# Altium schematic sheet rt10.SchDoc: rt10
size 885 x 596 mm; Origin: Eagle; Date: 3/22/2023 6:36:02 AM; SheetNumber: 1; GateName_1: G$1; SymbolName_1: FRAME_D_L; LibraryName: frames; DeviceSetName: FRAME_D_L; GateName_2: G$2; SymbolName_2: DOCFIELD; Sheet: Sheet:; REV: REV:
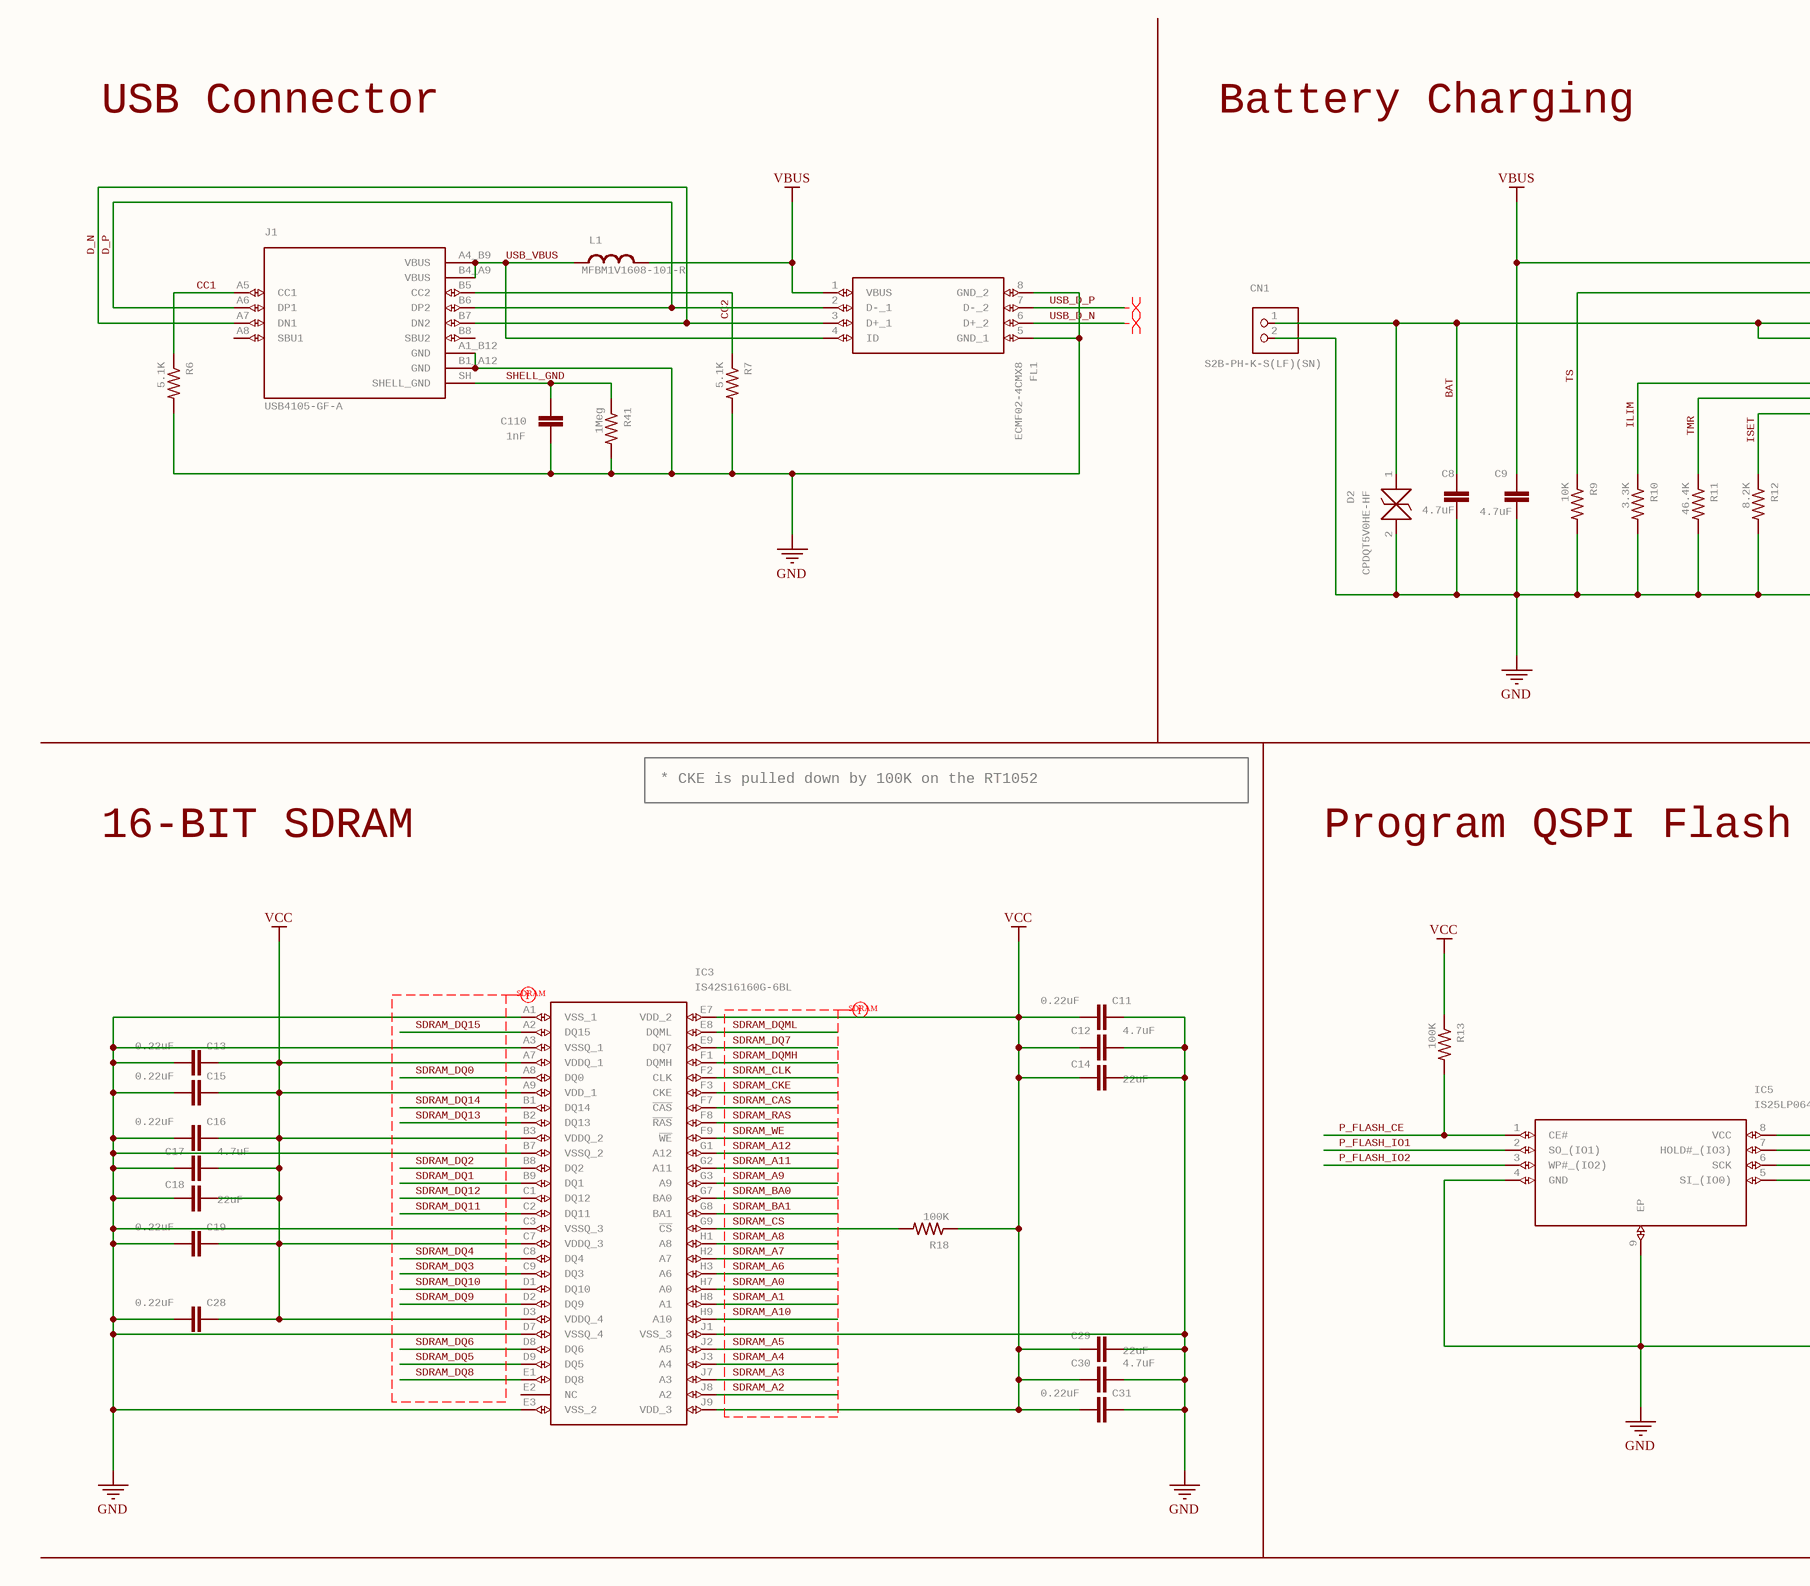
[diagram p0: rt10.SchDoc, top left]
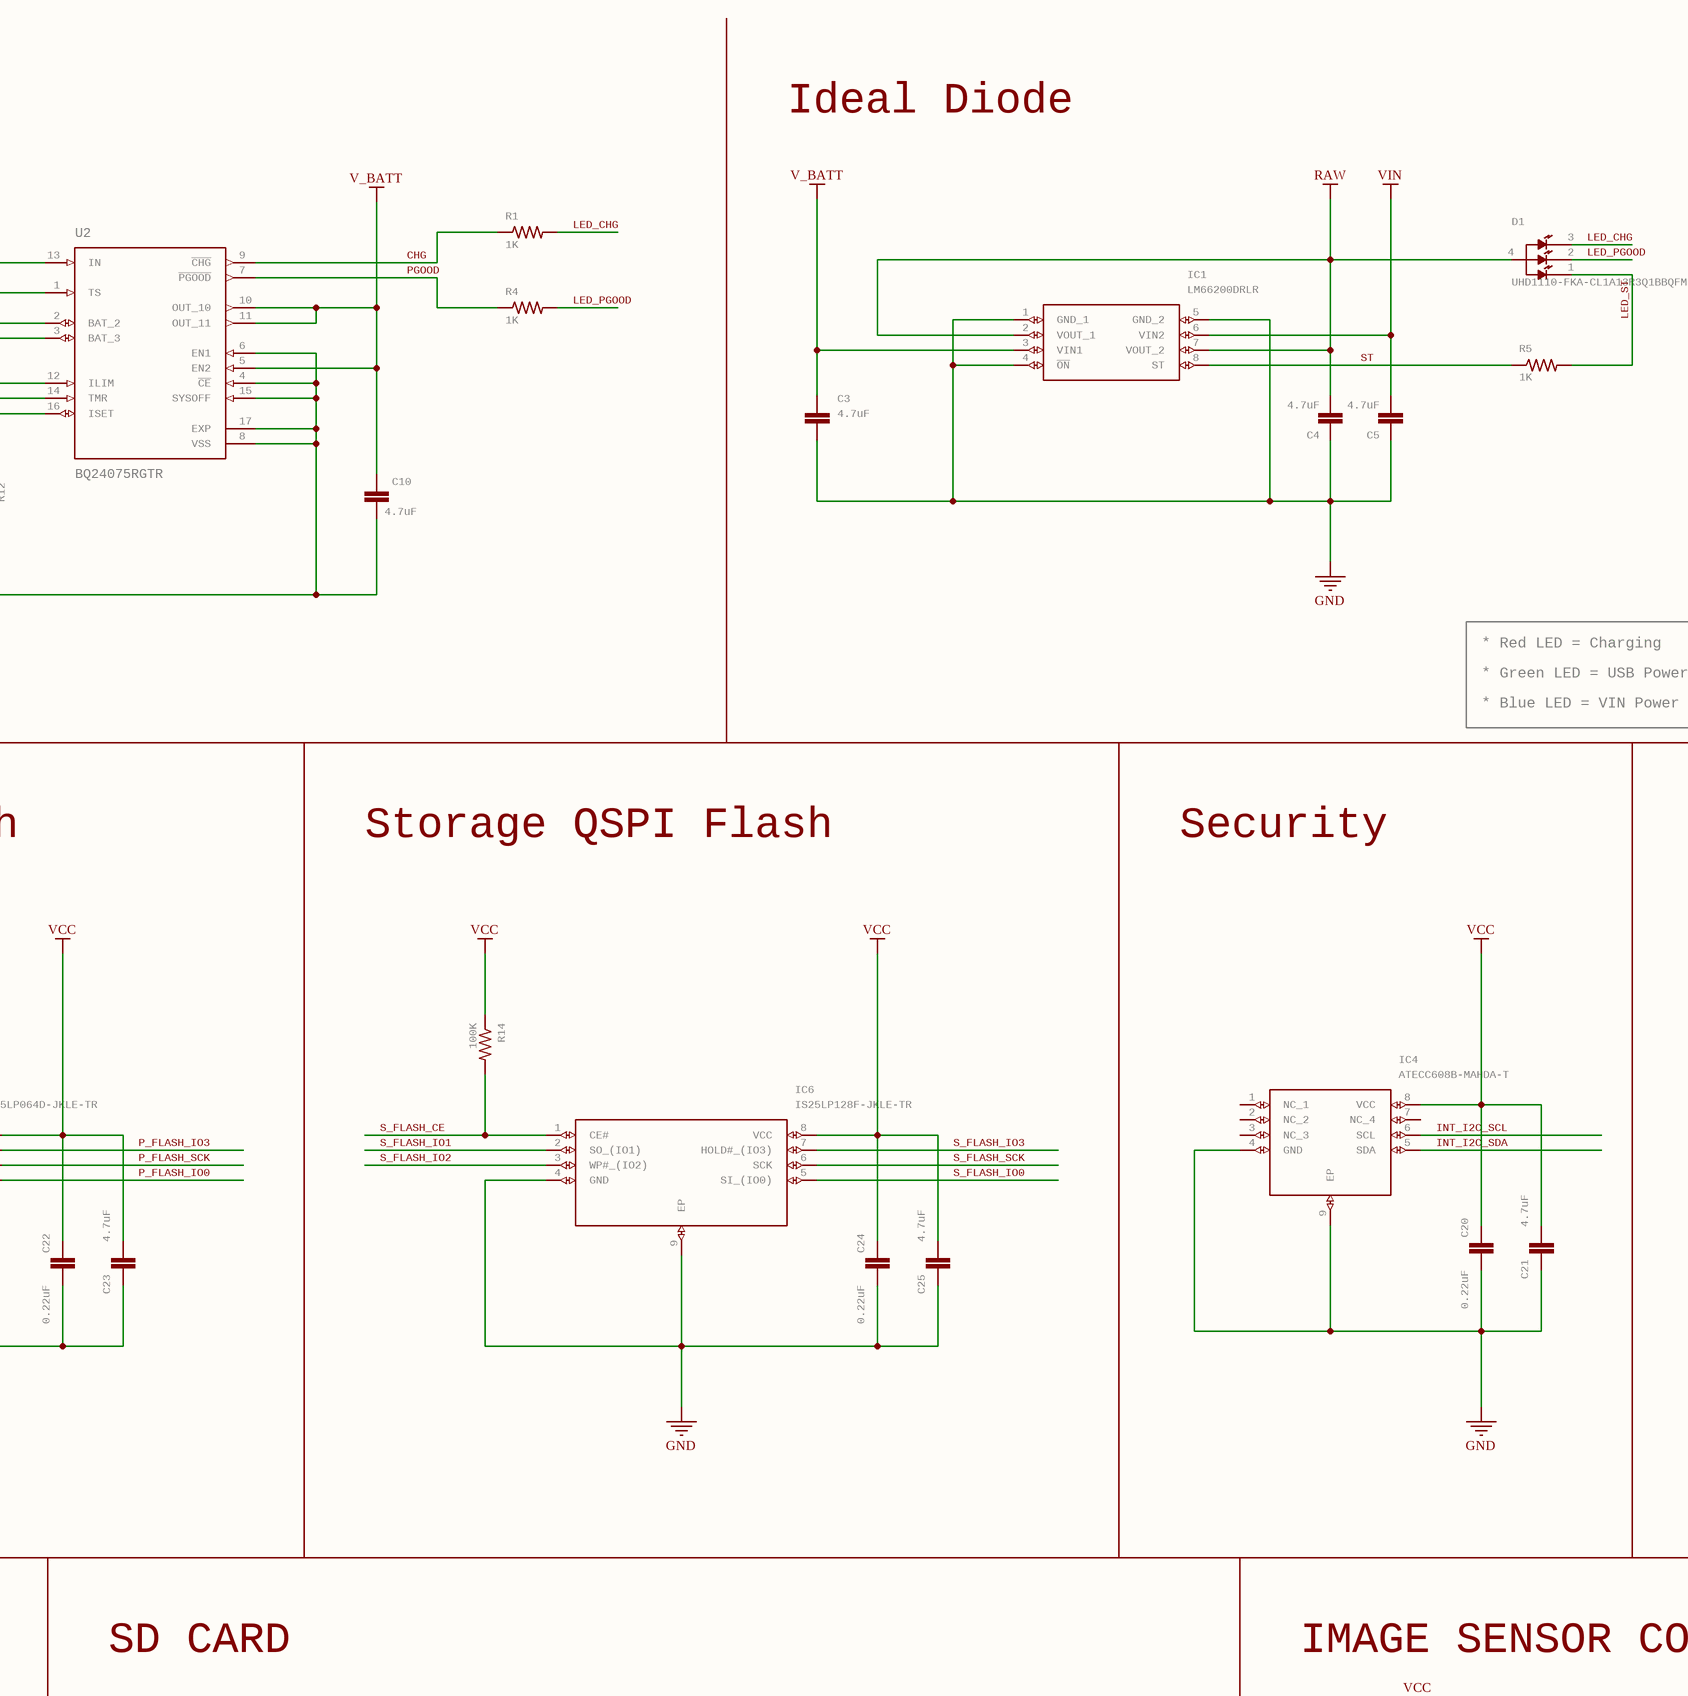
[diagram p1: rt10.SchDoc, top middle]
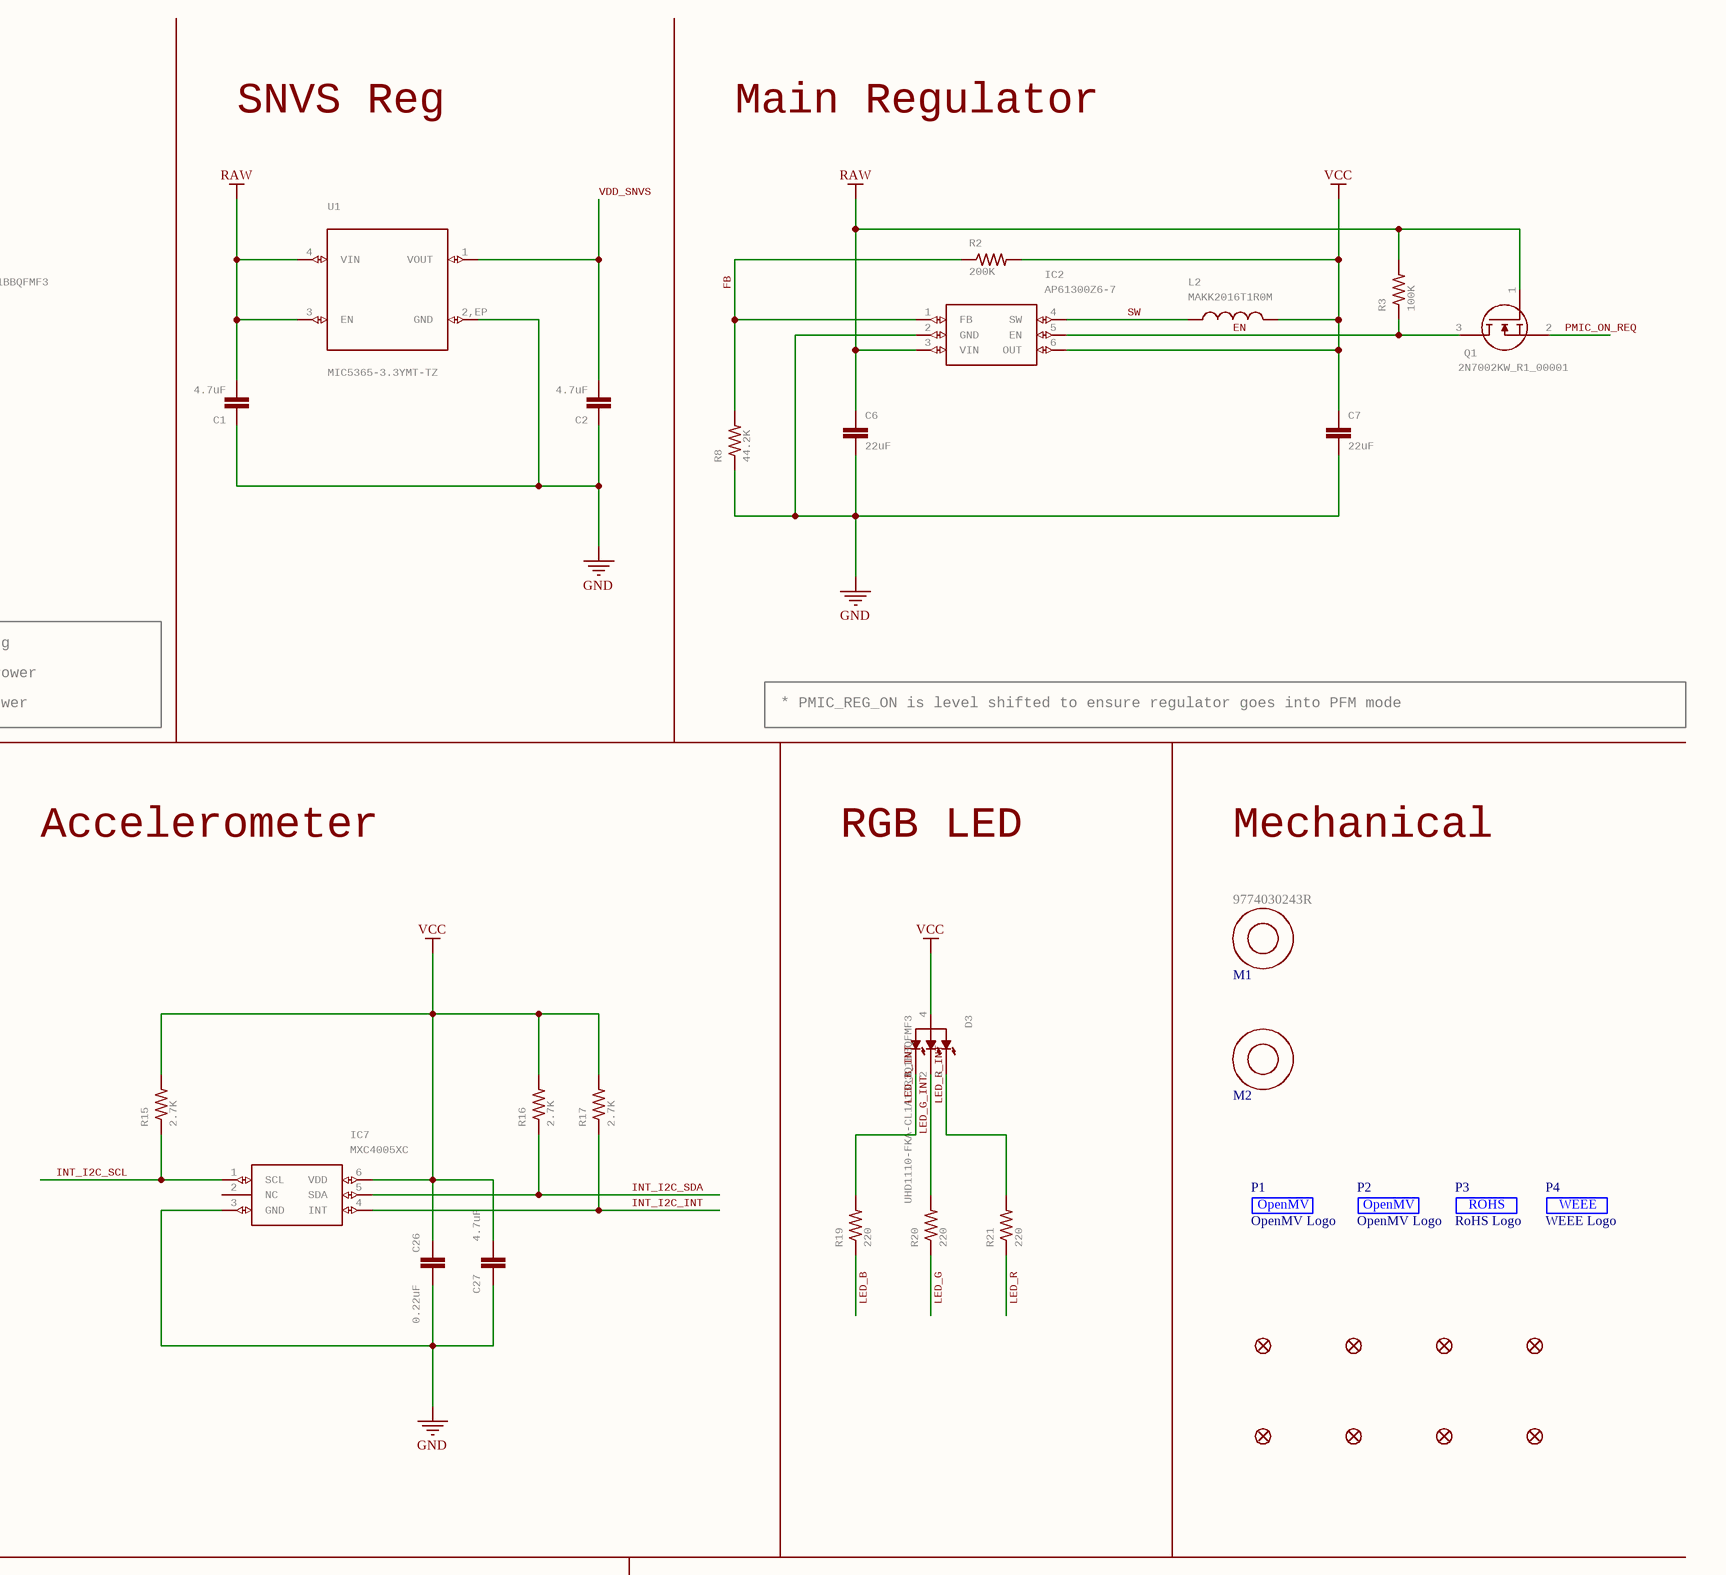
[diagram p2: rt10.SchDoc, top right]
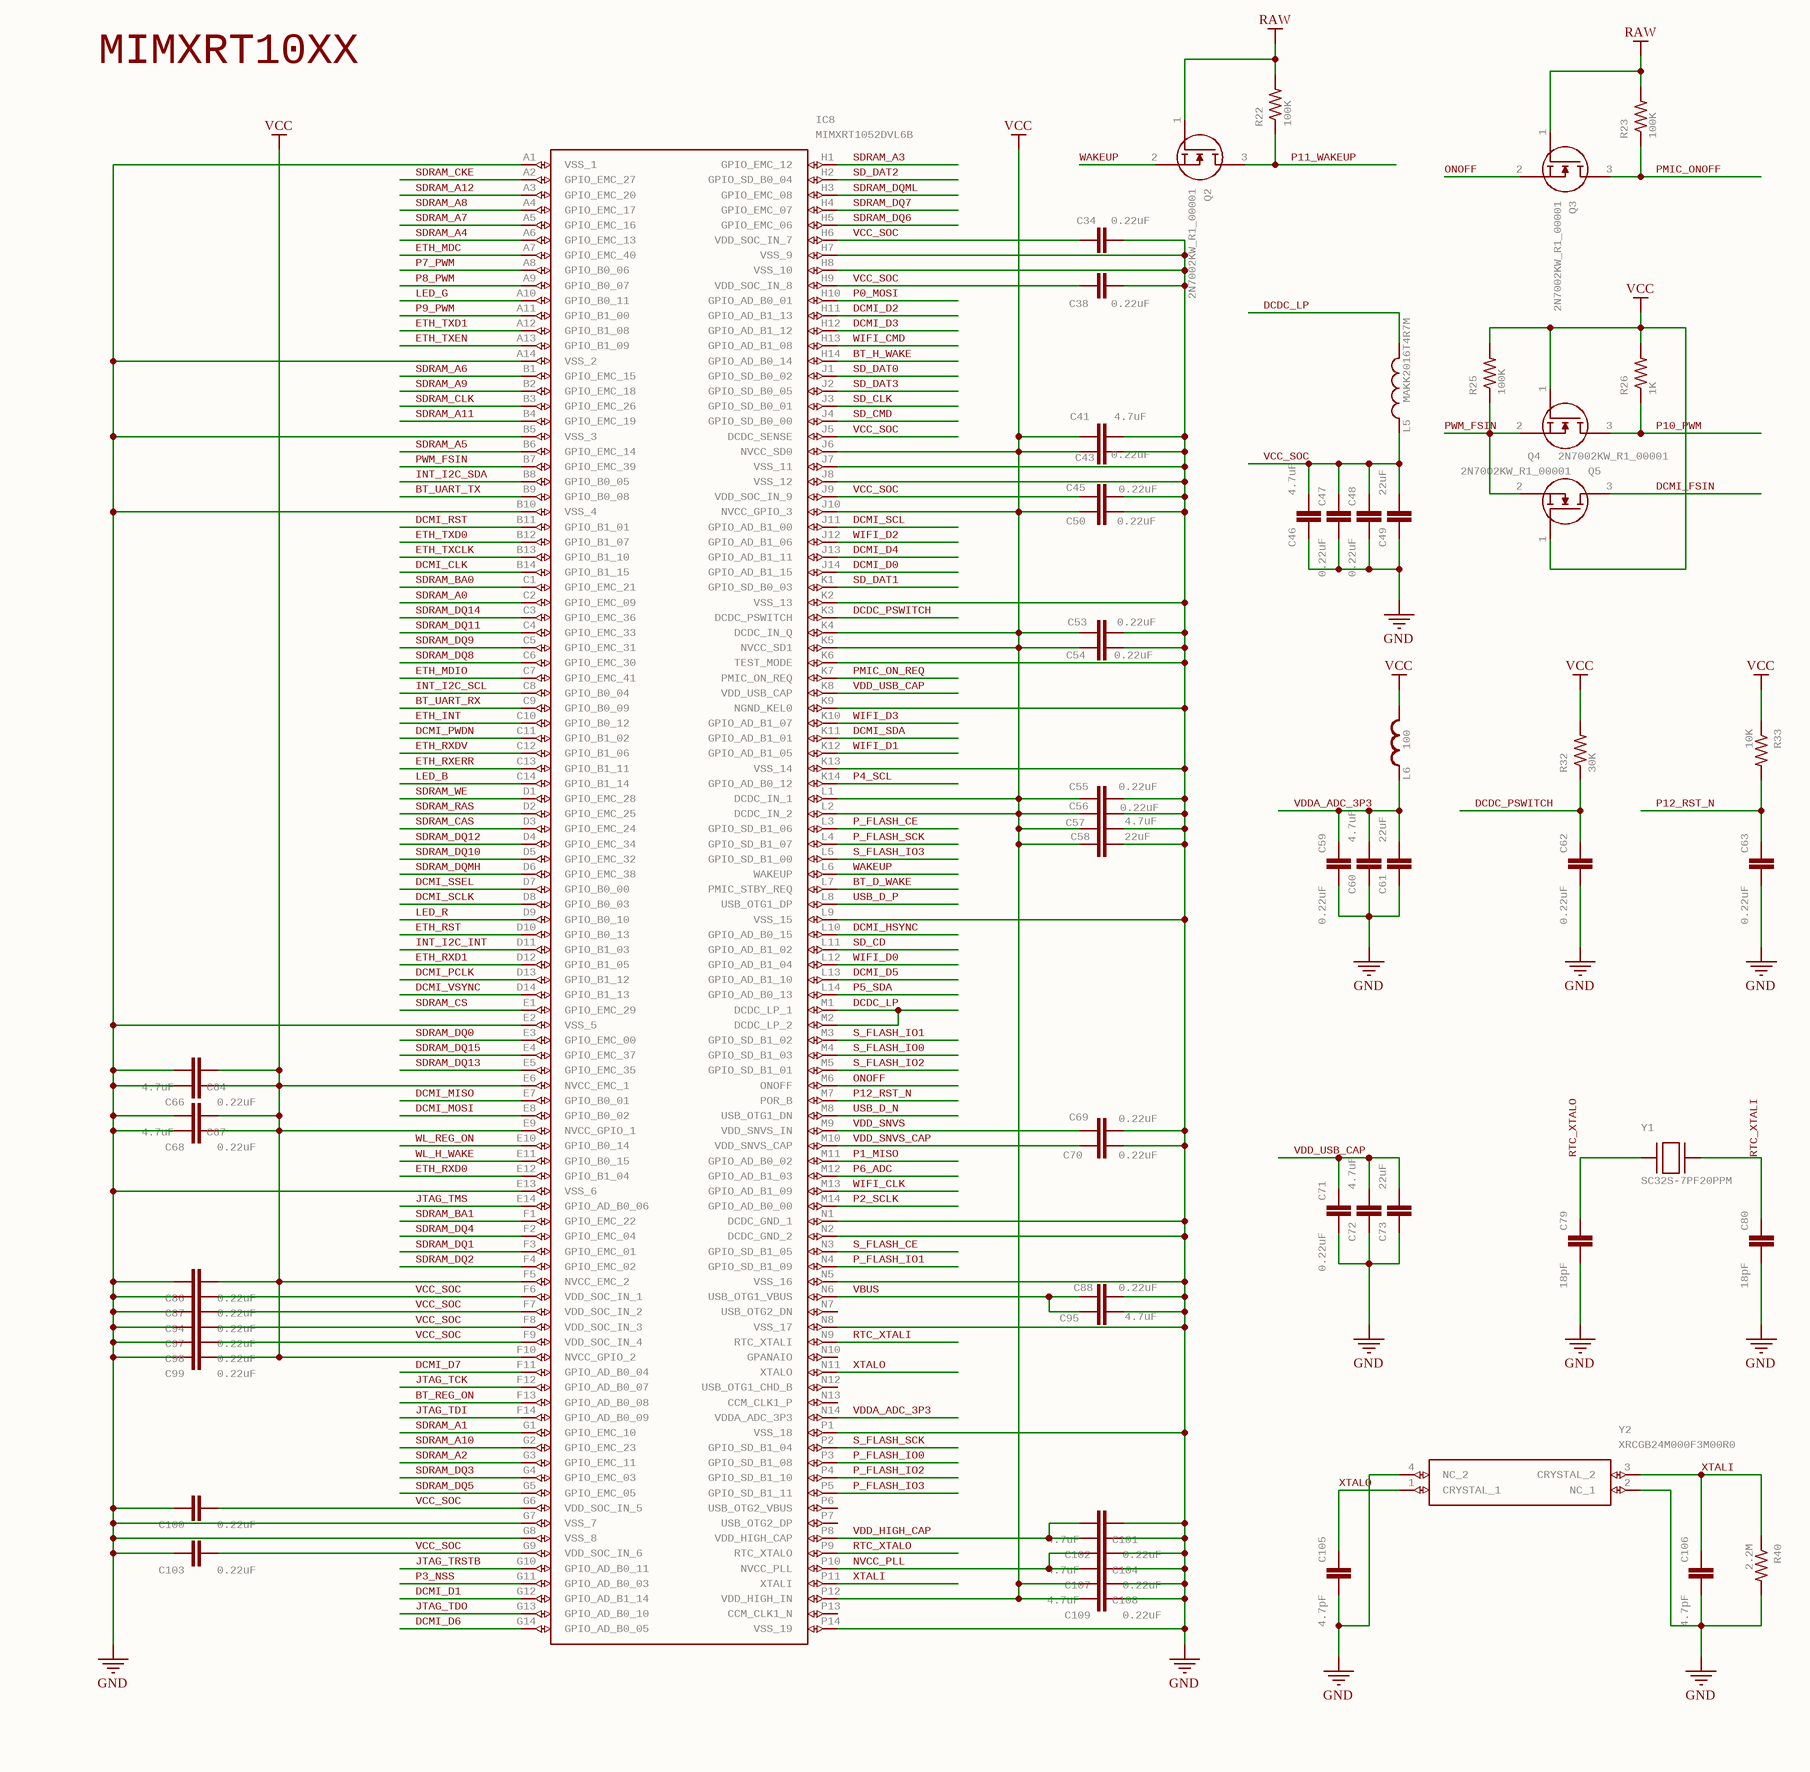
[diagram p3: rt10.SchDoc, bottom left]
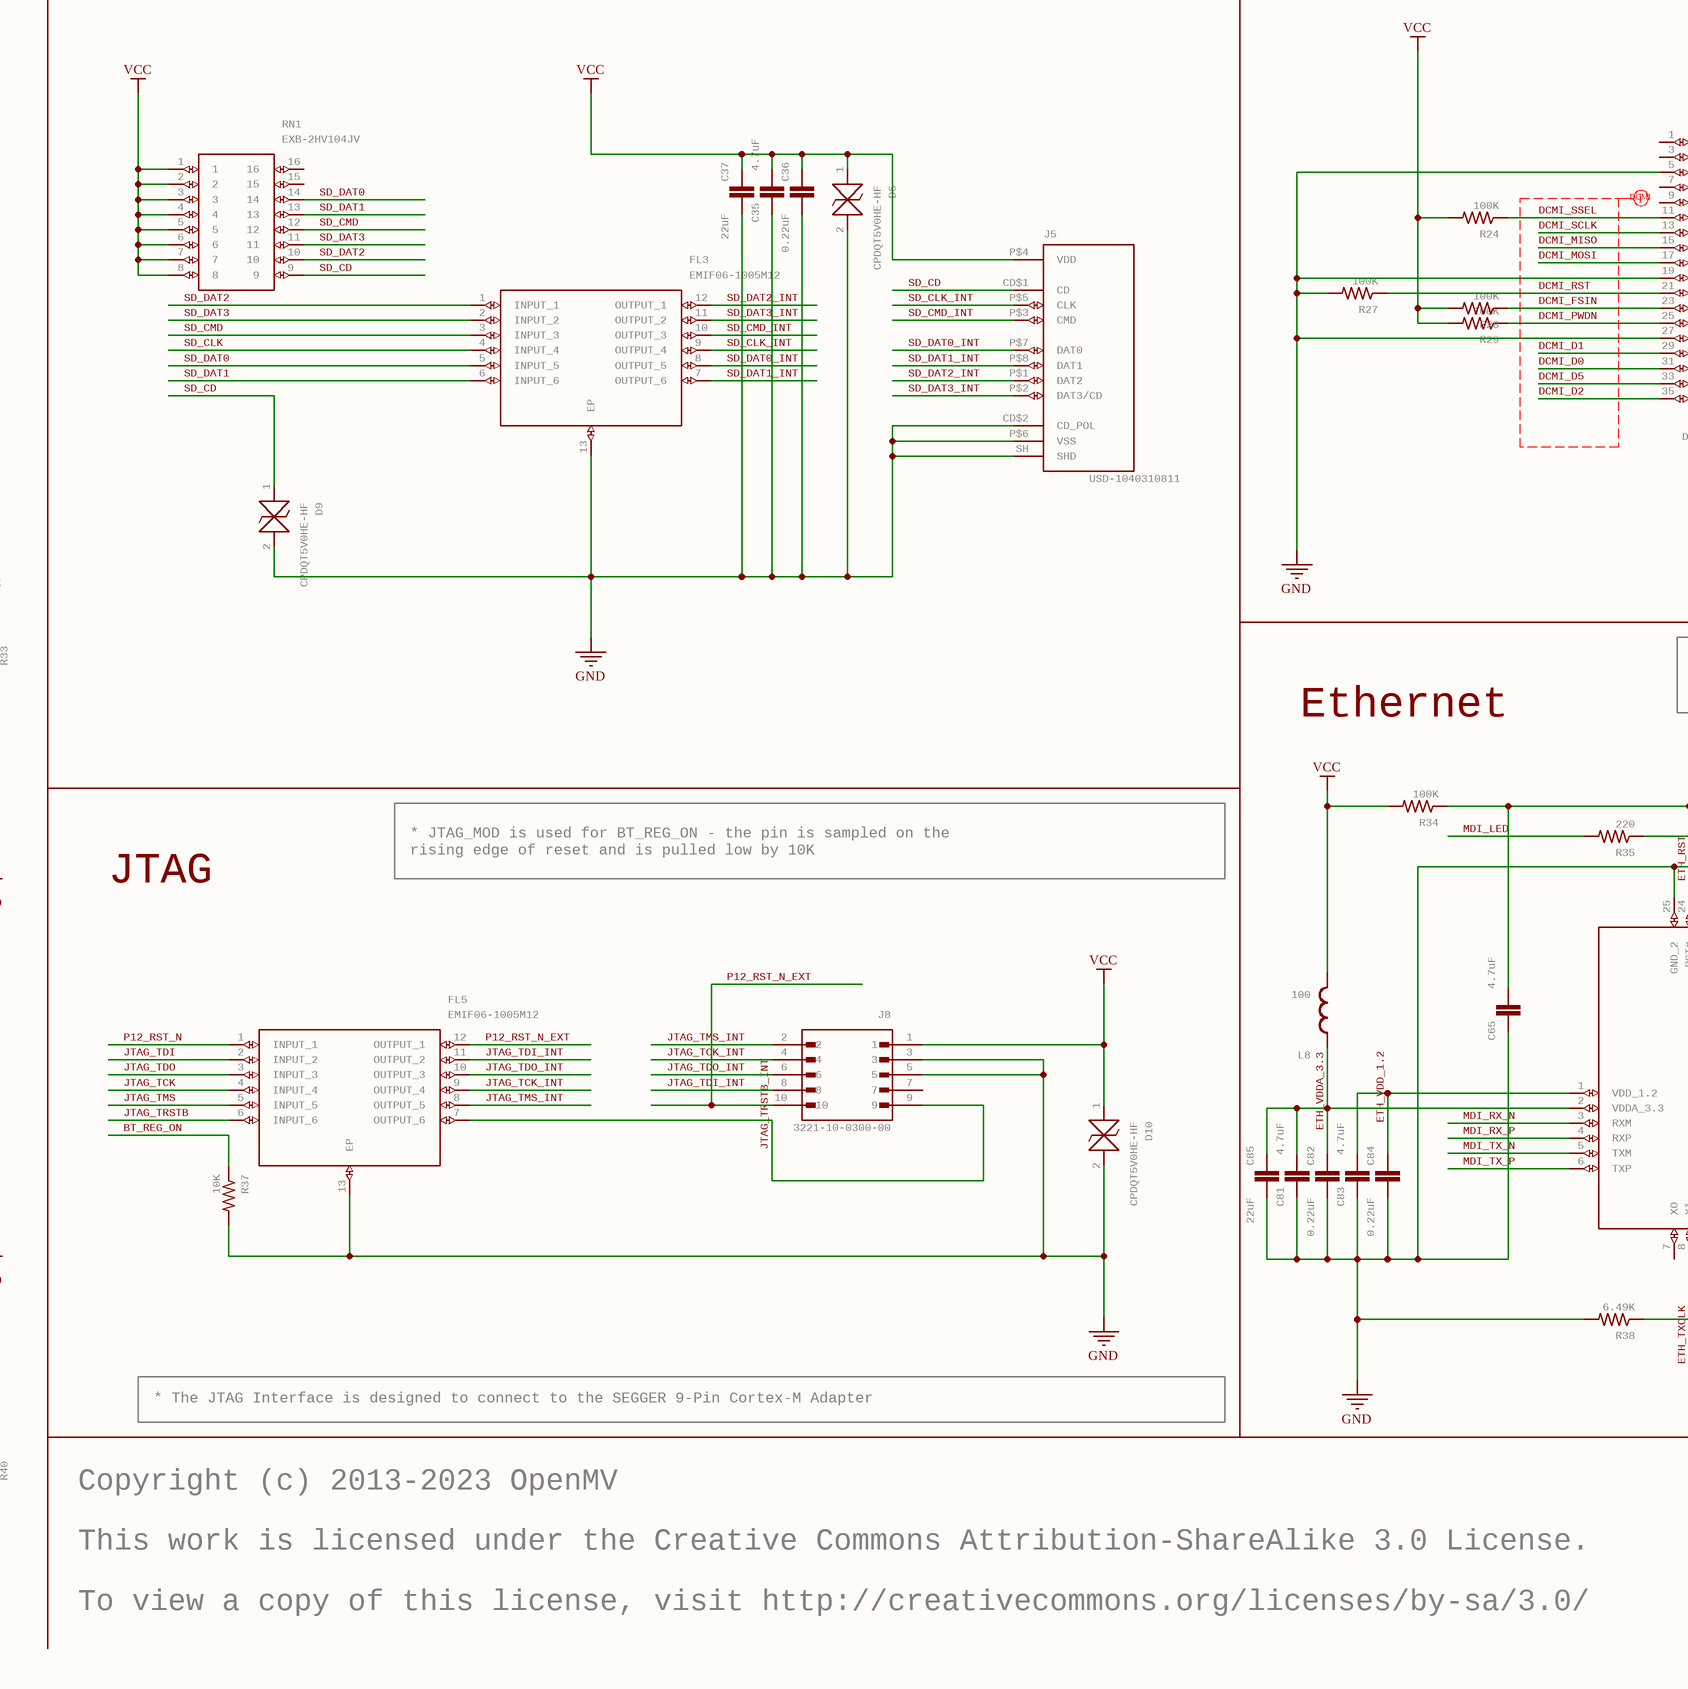
[diagram p4: rt10.SchDoc, bottom middle]
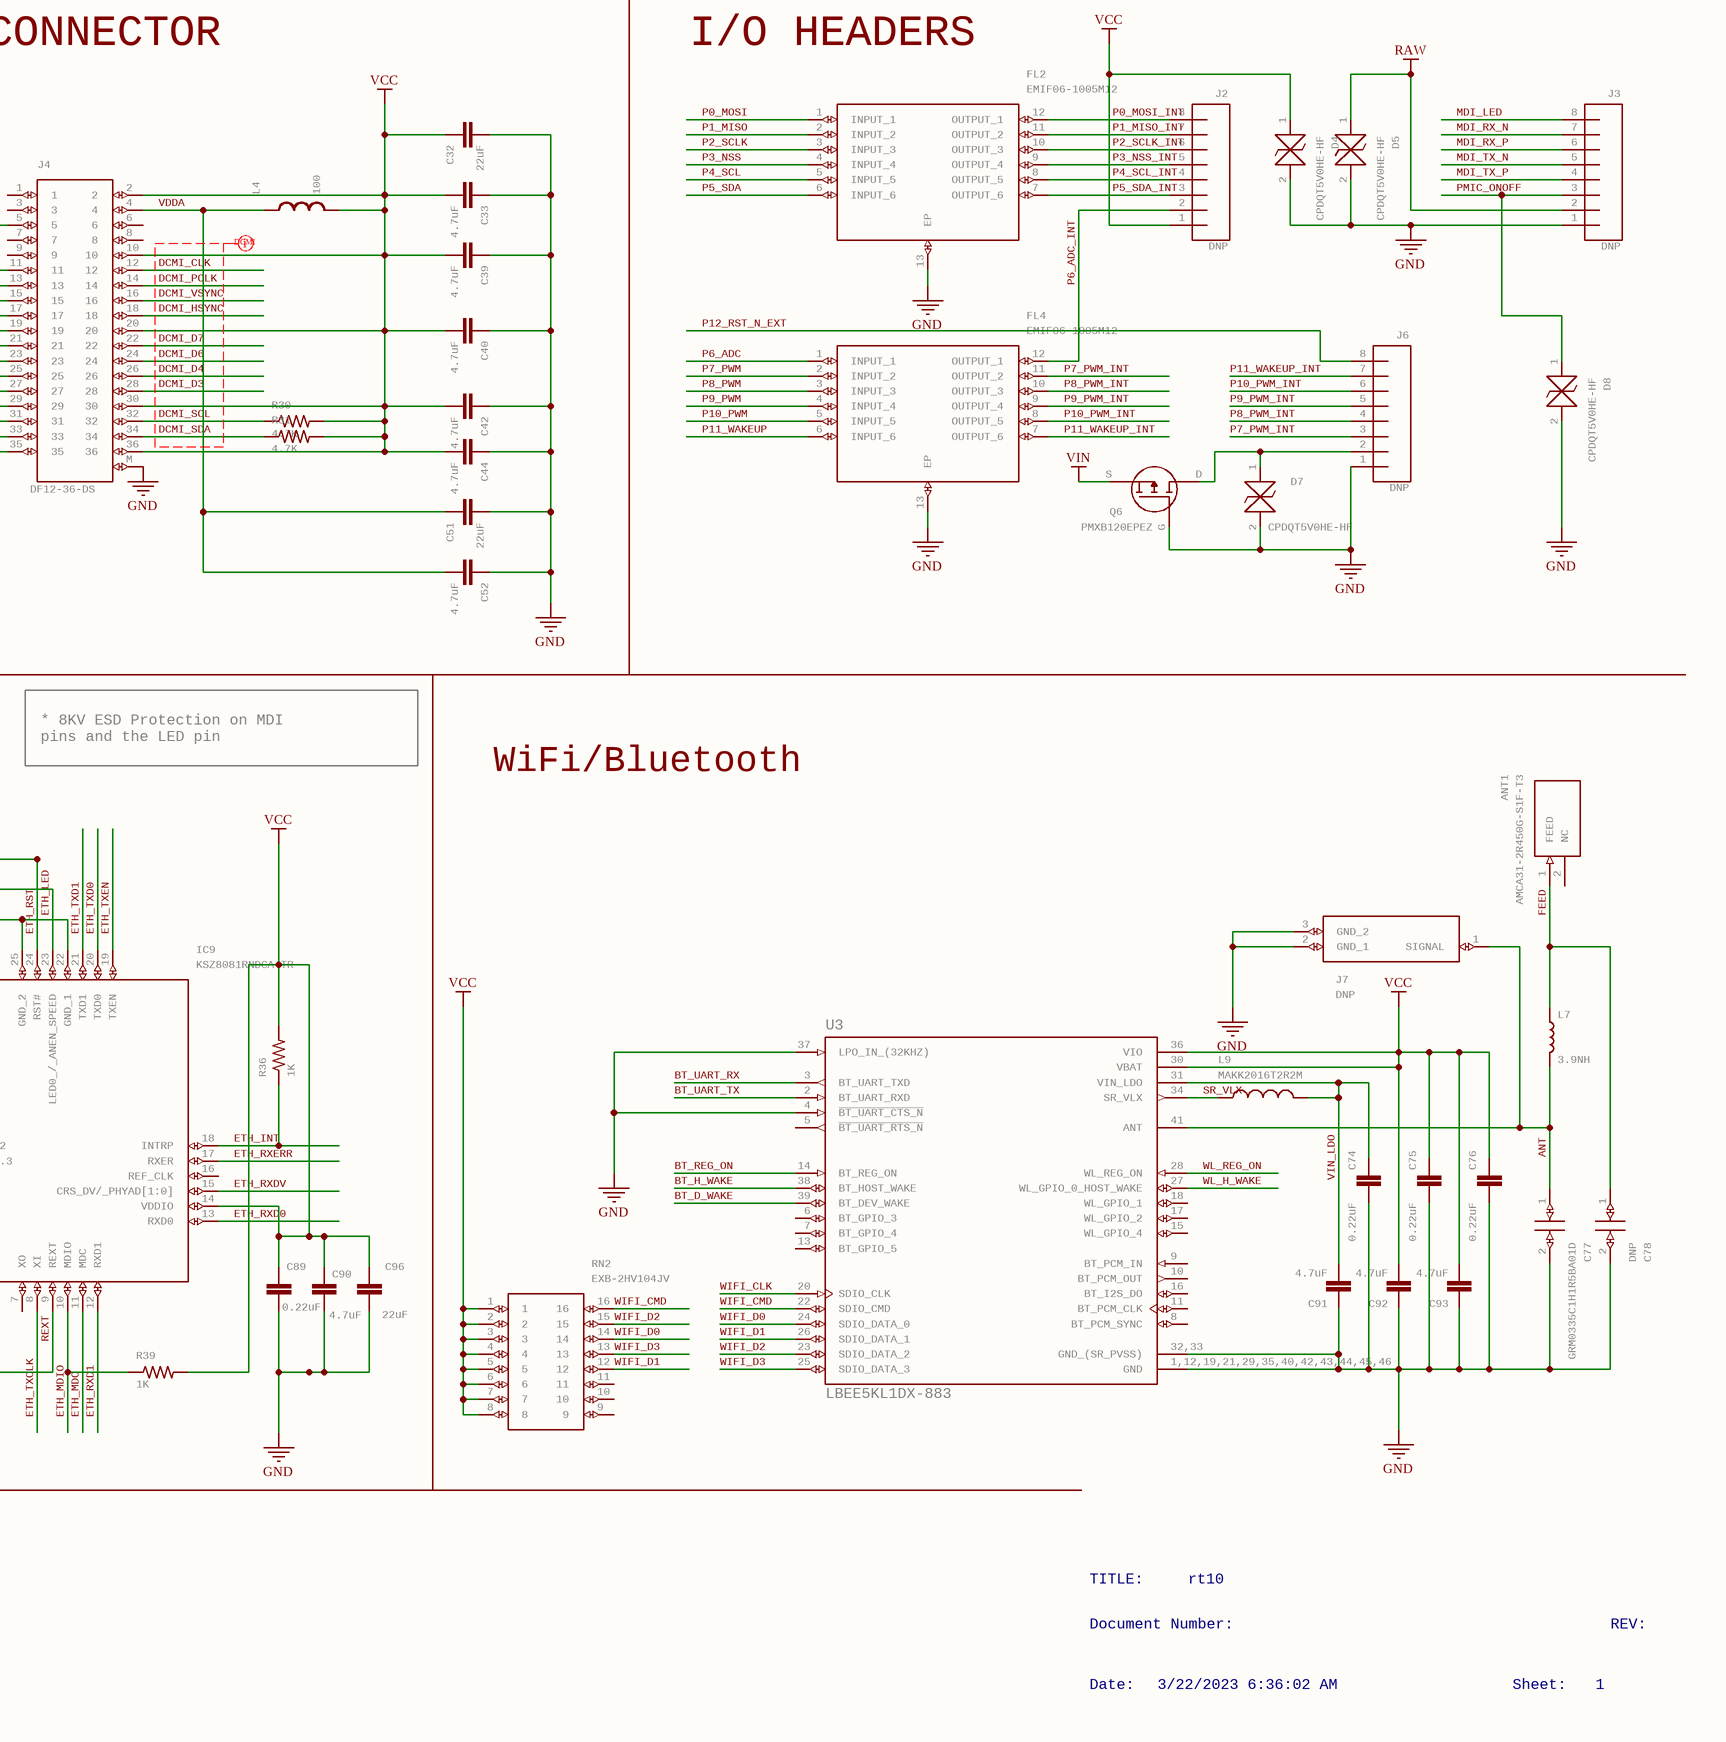
[diagram p5: rt10.SchDoc, bottom right]

## Parts
ANT1  AMCA31-2R450G-S1F-T3  [ANTC3216X140N]
C1  4.7uF  [0402-CAP]
C2  4.7uF  [0402-CAP]
C3  4.7uF  [0402-CAP]
C4  4.7uF  [0402-CAP]
C5  4.7uF  [0402-CAP]
C6  22uF  [0805]
C7  22uF  [0805]
C8  4.7uF  [0402-CAP]
C9  4.7uF  [0402-CAP]
C10  4.7uF  [0402-CAP]
C11  0.22uF  [C0201]
C12  4.7uF  [0402-CAP]
C13  0.22uF  [C0201]
C14  22uF  [0805]
C15  0.22uF  [C0201]
C16  0.22uF  [C0201]
C17  4.7uF  [0402-CAP]
C18  22uF  [0805]
C19  0.22uF  [C0201]
C20  0.22uF  [C0201]
C21  4.7uF  [0402-CAP]
C22  0.22uF  [C0201]
C23  4.7uF  [0402-CAP]
C24  0.22uF  [C0201]
C25  4.7uF  [0402-CAP]
C26  0.22uF  [C0201]
C27  4.7uF  [0402-CAP]
C28  0.22uF  [C0201]
C29  22uF  [0805]
C30  4.7uF  [0402-CAP]
C31  0.22uF  [C0201]
C32  22uF  [0805]
C33  4.7uF  [0402-CAP]
C34  0.22uF  [C0201]
C35  4.7uF  [0402-CAP]
C36  0.22uF  [C0201]
C37  22uF  [0805]
C38  0.22uF  [C0201]
C39  4.7uF  [0402-CAP]
C40  4.7uF  [0402-CAP]
C41  4.7uF  [0402-CAP]
C42  4.7uF  [0402-CAP]
C43  0.22uF  [C0201]
C44  4.7uF  [0402-CAP]
C45  0.22uF  [C0201]
C46  4.7uF  [0402-CAP]
C47  0.22uF  [C0201]
C48  0.22uF  [C0201]
C49  22uF  [0805]
C50  0.22uF  [C0201]
C51  22uF  [0805]
C52  4.7uF  [0402-CAP]
C53  0.22uF  [C0201]
C54  0.22uF  [C0201]
C55  0.22uF  [C0201]
C56  0.22uF  [C0201]
C57  4.7uF  [0402-CAP]
C58  22uF  [0805]
C59  0.22uF  [C0201]
C60  4.7uF  [0402-CAP]
C61  22uF  [0805]
C62  0.22uF  [C0201]
C63  0.22uF  [C0201]
C64  4.7uF  [0402-CAP]
C65  4.7uF  [0402-CAP]
C66  0.22uF  [C0201]
C67  4.7uF  [0402-CAP]
C68  0.22uF  [C0201]
C69  0.22uF  [C0201]
C70  0.22uF  [C0201]
C71  0.22uF  [C0201]
C72  4.7uF  [0402-CAP]
C73  22uF  [0805]
C74  0.22uF  [C0201]
C75  0.22uF  [C0201]
C76  0.22uF  [C0201]
C77  GRM0335C1H1R5BA01D  [CAPC0603X33N]
C78  DNP  [C0201-NO-3D]
C79  18pF  [C0201]
C80  18pF  [C0201]
C81  4.7uF  [0402-CAP]
C82  0.22uF  [C0201]
C83  4.7uF  [0402-CAP]
C84  0.22uF  [C0201]
C85  22uF  [0805]
C86  0.22uF  [C0201]
C87  0.22uF  [C0201]
C88  0.22uF  [C0201]
C89  0.22uF  [C0201]
C90  4.7uF  [0402-CAP]
C91  4.7uF  [0402-CAP]
C92  4.7uF  [0402-CAP]
C93  4.7uF  [0402-CAP]
C94  0.22uF  [C0201]
C95  4.7uF  [0402-CAP]
C96  22uF  [0805]
C97  0.22uF  [C0201]
C98  0.22uF  [C0201]
C99  0.22uF  [C0201]
C100  0.22uF  [C0201]
C101  4.7uF  [0402-CAP]
C102  0.22uF  [C0201]
C103  0.22uF  [C0201]
C104  4.7uF  [0402-CAP]
C105  4.7pF  [C0201]
C106  4.7pF  [C0201]
C107  0.22uF  [C0201]
C108  4.7uF  [0402-CAP]
C109  0.22uF  [C0201]
C110  1nF  [0402-CAP]
CN1  S2B-PH-K-S(LF)(SN)  [JST-PH-2-THM-RA]
D1  UHD1110-FKA-CL1A13R3Q1BBQFMF3  [LED_UHD1110-FKA-CL1A13R3Q1BBQFMF3]
D2  CPDQT5V0HE-HF  [CPDQT5V0HEHF]
D3  UHD1110-FKA-CL1A13R3Q1BBQFMF3  [LED_UHD1110-FKA-CL1A13R3Q1BBQFMF3]
D4  CPDQT5V0HE-HF  [CPDQT5V0HEHF]
D5  CPDQT5V0HE-HF  [CPDQT5V0HEHF]
D6  CPDQT5V0HE-HF  [CPDQT5V0HEHF]
D7  CPDQT5V0HE-HF  [CPDQT5V0HEHF]
D8  CPDQT5V0HE-HF  [CPDQT5V0HEHF]
D9  CPDQT5V0HE-HF  [CPDQT5V0HEHF]
D10  CPDQT5V0HE-HF  [CPDQT5V0HEHF]
FD1  FIDUCIAL1X2  [FIDUCIAL-1X2]  (value not drawn)
FD2  FIDUCIAL1X2  [FIDUCIAL-1X2]  (value not drawn)
FD3  FIDUCIAL1X2  [FIDUCIAL-1X2]  (value not drawn)
FD4  FIDUCIAL1X2  [FIDUCIAL-1X2]  (value not drawn)
FD5  FIDUCIAL1X2  [FIDUCIAL-1X2]  (value not drawn)
FD6  FIDUCIAL1X2  [FIDUCIAL-1X2]  (value not drawn)
FD7  FIDUCIAL1X2  [FIDUCIAL-1X2]  (value not drawn)
FD8  FIDUCIAL1X2  [FIDUCIAL-1X2]  (value not drawn)
FL1  ECMF02-4CMX8  [ECMF024CMX8]
FL2  EMIF06-1005M12  [SON40P150X250X65-13N]
FL3  EMIF06-1005M12  [SON40P150X250X65-13N]
FL4  EMIF06-1005M12  [SON40P150X250X65-13N]
FL5  EMIF06-1005M12  [SON40P150X250X65-13N]
IC1  LM66200DRLR  [SOTFL50P160X60-8N]
IC2  AP61300Z6-7  [SOTFL50P162X60-6N]
IC3  IS42S16160G-6BL  [BGA54C80P9X9_800X800X120]
IC4  ATECC608B-MAHDA-T  [SON50P300X200X60-9N]
IC5  IS25LP064D-JKLE-TR  [SON127P500X595X80-9N]
IC6  IS25LP128F-JKLE-TR  [SON127P500X595X80-9N]
IC7  MXC4005XC  [MXC4005XC]
IC8  MIMXRT1052DVL6B  [BGA196C65P14X14_1000X1000X143]
IC9  KSZ8081RNDCA-TR  [QFN50P400X400X90-25N]
J1  USB4105-GF-A  [GCT_USB4105-GF-A]
J2  DNP  [1X08]
J3  DNP  [1X08]
J4  DF12-36-DS  [DF12-36-DS]
J5  USD-1040310811  [1040310811]
J6  DNP  [1X08]
J7  DNP  [23370191-NO-3D]
J8  3221-10-0300-00  [CNC_3221-10-0300-00]
L1  MFBM1V1608-101-R  [0603-RES]
L2  MAKK2016T1R0M  [INDC2016X100N]
L4  100  [C0402]
L5  MAKK2016T4R7M  [INDC2016X100N]
L6  100  [C0402]
L7  3.9NH  [0402]
L8  100  [C0402]
L9  MAKK2016T2R2M  [INDC2016X100N]
M1  9774030243R  [9774030243R]
M2  9774030243R  [9774030243R]  (value not drawn)
P1  OpenMV Logo  [OMV-LOGO-SMALL]  (no BOM)
P2  OpenMV Logo  [OMV-LOGO-SMALL]  (no BOM)
P3  RoHS Logo  [ROHS]  (no BOM)
P4  WEEE Logo  [WEEE]  (no BOM)
Q1  2N7002KW_R1_00001  [SOT65P210X110-3N]
Q2  2N7002KW_R1_00001  [SOT65P210X110-3N]
Q3  2N7002KW_R1_00001  [SOT65P210X110-3N]
Q4  2N7002KW_R1_00001  [SOT65P210X110-3N]
Q5  2N7002KW_R1_00001  [SOT65P210X110-3N]
Q6  PMXB120EPEZ  [PMXB120EPEZ]
R1  1K  [0402-RES]
R2  200K  [0402-RES]
R3  100K  [0402-RES]
R4  1K  [0402-RES]
R5  1K  [0402-RES]
R6  5.1K  [0402-RES]
R7  5.1K  [0402-RES]
R8  44.2K  [0402-RES]
R9  10K  [0402-RES]
R10  3.3K  [0402-RES]
R11  46.4K  [0402-RES]
R12  8.2K  [0402-RES]
R13  100K  [0402-RES]
R14  100K  [0402-RES]
R15  2.7K  [0402-RES]
R16  2.7K  [0402-RES]
R17  2.7K  [0402-RES]
R18  100K  [0402-RES]
R19  220  [0402-RES]
R20  220  [0402-RES]
R21  220  [0402-RES]
R22  100K  [0402-RES]
R23  100K  [0402-RES]
R24  100K  [0402-RES]
R25  100K  [0402-RES]
R26  1K  [0402-RES]
R27  100K  [0402-RES]
R28  100K  [0402-RES]
R29  100K  [0402-RES]
R30  4.7K  [0402-RES]
R31  4.7K  [0402-RES]
R32  30K  [0201-RES]
R33  10K  [0402-RES]
R34  100K  [0402-RES]
R35  220  [0402-RES]
R36  1K  [0402-RES]
R37  10K  [0402-RES]
R38  6.49K  [0402-RES]
R39  1K  [0402-RES]
R40  2.2M  [0402-RES]
R41  1Meg  [0402-RES]
RN1  EXB-2HV104JV  [EXB2HV104JV]
RN2  EXB-2HV104JV  [EXB2HV104JV]
U1  MIC5365-3.3YMT-TZ  [VREG_MIC5365-3.3YMT-TZ]
U2  BQ24075RGTR  [QFN50P300X300X100-17N]
U3  LBEE5KL1DX-883  [XCVR_LBEE5KL1DX-TEMP]
Y1  SC32S-7PF20PPM  [XTAL_ABS07-32.768KHZ-7-T]
Y2  XRCGB24M000F3M00R0  [XRCGB24M000F3M00R0]

## Nets
GND: C1.1 C2.1 C3.1 C4.1 C5.1 C6.2 C7.2 C8.1 C9.1 C10.1 C11.1 C12.2 C13.2 C14.2 C15.2 C16.2 C17.1 C18.1 C19.2 C20.2 C21.1 C22.2 C23.1 C24.2 C25.1 C26.2 C27.1 C28.2 C29.2 C30.2 C31.1 C32.2 C33.1 C34.2 C35.1 C36.2 C37.2 C38.2 C39.1 C40.1 C41.1 C42.1 C43.2 C44.1 C45.2 C46.1 C47.2 C48.2 C49.1 C50.2 C51.2 C52.1 C53.2 C54.2 C55.2 C56.2 C57.1 C58.1 C59.2 C60.1 C61.1 C62.2 C63.2 C64.2 C65.1 C66.1 C67.2 C68.1 C69.2 C70.2 C71.2 C72.1 C73.1 C74.2 C75.2 C76.2 C77.2 C78.2 C79.2 C80.2 C81.1 C82.2 C83.1 C84.2 C85.2 C86.1 C87.1 C88.2 C89.2 C90.1 C91.1 C92.1 C93.1 C94.1 C95.1 C96.2 C97.1 C98.1 C99.1 C100.1 C101.1 C102.2 C103.1 C104.1 C105.2 C106.2 C107.2 C108.1 C109.2 C110.2 CN1.2 D2.2 D4.2 D5.2 D6.2 D7.2 D8.2 D9.2 D10.2 FL1.5(GND_1) FL1.8(GND_2) FL2.13(EP) FL3.13(EP) FL4.13(EP) FL5.13(EP) IC1.1(GND_1) IC1.4(~{ON}) IC1.5(GND_2) IC2.2(GND) IC3.A1(VSS_1) IC3.A3(VSSQ_1) IC3.B7(VSSQ_2) IC3.C3(VSSQ_3) IC3.D7(VSSQ_4) IC3.E3(VSS_2) IC3.J1(VSS_3) IC4.4(GND) IC4.9(EP) IC5.4(GND) IC5.9(EP) IC6.4(GND) IC6.9(EP) IC7.3(GND) IC8.A1(VSS_1) IC8.A14(VSS_2) IC8.B5(VSS_3) IC8.B10(VSS_4) IC8.E2(VSS_5) IC8.E13(VSS_6) IC8.G7(VSS_7) IC8.G8(VSS_8) IC8.H7(VSS_9) IC8.H8(VSS_10) IC8.J7(VSS_11) IC8.J8(VSS_12) IC8.K2(VSS_13) IC8.K6(TEST_MODE) IC8.K9(NGND_KEL0) IC8.K13(VSS_14) IC8.L9(VSS_15) IC8.N1(DCDC_GND_1) IC8.N2(DCDC_GND_2) IC8.N5(VSS_16) IC8.N8(VSS_17) IC8.P1(VSS_18) IC8.P14(VSS_19) IC9.22(GND_1) IC9.25(GND_2) J1.A1_B12(GND) J1.B1_A12(GND) J3.1 J4.5 J4.19 J4.27 J4.M J5.CD$2(CD_POL) J5.P$6(VSS) J5.SH(SHD) J6.1 J7.2(GND_1) J7.3(GND_2) J8.3 J8.5 Q6.G R6.2 R7.2 R8.1 R9.2 R10.2 R11.2 R12.2 R27.2 R37.2 R38.2 R40.2 R41.2 U1.2,EP(GND) U2.4(~{CE}) U2.6(EN1) U2.8(VSS) U2.15(SYSOFF) U2.17(EXP) U3.1,12,19,21,29,35,40,42,43,44,45,46(GND) U3.4(~{BT_UART_CTS_N}) U3.32,33(GND_(SR_PVSS)) U3.37(LPO_IN_(32KHZ)) Y2.2(NC_1) Y2.4(NC_2)
RAW: C1.2 C4.2 C6.1 D1.4(ANODE) D5.1 IC1.2(VOUT_1) IC1.7(VOUT_2) IC2.3(VIN) J3.2 Q1.1(G) Q2.1(G) Q3.1(G) R3.2 R22.2 R23.2 U1.3(EN) U1.4(VIN)
V_BATT: C3.2 C10.2 IC1.3(VIN1) U2.5(EN2) U2.10(OUT_10) U2.11(OUT_11)
VBUS: C9.2 C88.1 C95.2 FL1.1(VBUS) IC8.N6(USB_OTG1_VBUS) L1.2 U2.13(IN)
VCC: C7.1 C11.2 C12.1 C13.1 C14.1 C15.1 C16.1 C17.2 C18.2 C19.1 C20.1 C21.2 C22.1 C23.2 C24.1 C25.2 C26.1 C27.2 C28.1 C29.1 C30.1 C31.2 C32.1 C33.2 C35.2 C36.1 C37.1 C39.2 C40.2 C41.2 C42.2 C43.1 C44.2 C50.1 C53.1 C54.1 C55.1 C56.1 C57.2 C58.2 C64.1 C66.2 C67.1 C68.2 C75.1 C76.1 C86.2 C89.1 C90.2 C92.2 C93.2 C96.1 C99.2 C108.2 C109.1 D3.4(ANODE) D4.1 D6.1 D10.1 IC2.6(OUT) IC3.A7(VDDQ_1) IC3.A9(VDD_1) IC3.B3(VDDQ_2) IC3.C7(VDDQ_3) IC3.D3(VDDQ_4) IC3.E7(VDD_2) IC3.J9(VDD_3) IC4.8(VCC) IC5.8(VCC) IC6.8(VCC) IC7.6(VDD) IC8.E6(NVCC_EMC_1) IC8.E9(NVCC_GPIO_1) IC8.F5(NVCC_EMC_2) IC8.F10(NVCC_GPIO_2) IC8.J6(NVCC_SD0) IC8.J10(NVCC_GPIO_3) IC8.K4(DCDC_IN_Q) IC8.K5(NVCC_SD1) IC8.L1(DCDC_IN_1) IC8.L2(DCDC_IN_2) IC8.P12(VDD_HIGH_IN) IC9.14(VDDIO) J2.1 J4.2 J4.10 J4.20 J4.30 J4.36 J5.P$4(VDD) J8.1 L2.2 L4.2 L6.2 L8.2 Q4.1(G) Q5.1(G) R2.2 R13.1 R14.1 R15.2 R16.2 R17.2 R18.1 R24.2 R25.2 R26.2 R28.2 R29.2 R30.2 R31.2 R32.2 R33.1 R34.2 R36.2 R39.2 RN1.1 RN1.2 RN1.3 RN1.4 RN1.5 RN1.6 RN1.7 RN1.8 RN2.1 RN2.2 RN2.3 RN2.4 RN2.5 RN2.6 RN2.7 RN2.8 U3.30(VBAT) U3.36(VIO)
VIN: C5.2 IC1.6(VIN2) Q6.S
ANT: C77.1 J7.1(SIGNAL) L7.2 U3.41(ANT)
BAT: C8.2 CN1.1 D2.1 U2.2(BAT_2) U2.3(BAT_3)
BT_D_WAKE: IC8.L7(PMIC_STBY_REQ) U3.39(BT_DEV_WAKE)
BT_H_WAKE: IC8.H14(GPIO_AD_B0_14) U3.38(BT_HOST_WAKE)
BT_REG_ON: IC8.F13(GPIO_AD_B0_08) R37.1 U3.14(BT_REG_ON)
BT_UART_RX: IC8.C9(GPIO_B0_09) U3.3(BT_UART_TXD)
BT_UART_TX: IC8.B9(GPIO_B0_08) U3.2(BT_UART_RXD)
CC1: J1.A5(CC1) R6.1
CC2: J1.B5(CC2) R7.1
CHG: R1.1 U2.9(~{CHG})
D_N: FL1.3(D+_1) J1.A7(DN1) J1.B7(DN2)
D_P: FL1.2(D-_1) J1.A6(DP1) J1.B6(DP2)
DCDC_LP: IC8.M1(DCDC_LP_1) IC8.M2(DCDC_LP_2) L5.2
DCDC_PSWITCH: C62.1 IC8.K3(DCDC_PSWITCH) R32.1
DCMI_CLK: IC8.B14(GPIO_B1_15) J4.12
DCMI_D0: IC8.J14(GPIO_AD_B1_15) J4.31
DCMI_D1: IC8.G12(GPIO_AD_B1_14) J4.29
DCMI_D2: IC8.H11(GPIO_AD_B1_13) J4.35
DCMI_D3: IC8.H12(GPIO_AD_B1_12) J4.28
DCMI_D4: IC8.J13(GPIO_AD_B1_11) J4.26
DCMI_D5: IC8.L13(GPIO_AD_B1_10) J4.33
DCMI_D6: IC8.G14(GPIO_AD_B0_05) J4.24
DCMI_D7: IC8.F11(GPIO_AD_B0_04) J4.22
DCMI_FSIN: J4.23 Q5.3(D) R28.1
DCMI_HSYNC: IC8.L10(GPIO_AD_B0_15) J4.18
DCMI_MISO: IC8.E7(GPIO_B0_01) J4.15
DCMI_MOSI: IC8.E8(GPIO_B0_02) J4.17
DCMI_PCLK: IC8.D13(GPIO_B1_12) J4.14
DCMI_PWDN: IC8.C11(GPIO_B1_02) J4.25 R29.1
DCMI_RST: IC8.B11(GPIO_B1_01) J4.21 R27.1
DCMI_SCL: IC8.J11(GPIO_AD_B1_00) J4.32 R30.1
DCMI_SCLK: IC8.D8(GPIO_B0_03) J4.13
DCMI_SDA: IC8.K11(GPIO_AD_B1_01) J4.34 R31.1
DCMI_SSEL: IC8.D7(GPIO_B0_00) J4.11 R24.1
DCMI_VSYNC: IC8.D14(GPIO_B1_13) J4.16
EN: IC2.5(EN) Q1.3(D) R3.1
ETH_INT: IC8.C10(GPIO_B0_12) IC9.18(INTRP) R36.1
ETH_LED: IC9.23(LED0_/_ANEN_SPEED) R35.1
ETH_MDC: IC8.A7(GPIO_EMC_40) IC9.11(MDC)
ETH_MDIO: IC8.C7(GPIO_EMC_41) IC9.10(MDIO) R39.1
ETH_RST: C65.2 IC8.D10(GPIO_B0_13) IC9.24(RST#) R34.1
ETH_RXD0: IC8.E12(GPIO_B1_04) IC9.13(RXD0)
ETH_RXD1: IC8.D12(GPIO_B1_05) IC9.12(RXD1)
ETH_RXDV: IC8.C12(GPIO_B1_06) IC9.15(CRS_DV/_PHYAD[1:0])
ETH_RXERR: IC8.C13(GPIO_B1_11) IC9.17(RXER)
ETH_TXCLK: IC8.B13(GPIO_B1_10) IC9.8(XI)
ETH_TXD0: IC8.B12(GPIO_B1_07) IC9.20(TXD0)
ETH_TXD1: IC8.A12(GPIO_B1_08) IC9.21(TXD1)
ETH_TXEN: IC8.A13(GPIO_B1_09) IC9.19(TXEN)
ETH_VDD_1.2: C83.2 C84.1 IC9.1(VDD_1.2)
ETH_VDDA_3.3: C81.2 C82.1 C85.1 IC9.2(VDDA_3.3) L8.1
FB: IC2.1(FB) R2.1 R8.2
FEED: ANT1.1(FEED) C78.1 L7.1
ILIM: R10.1 U2.12(ILIM)
INT_I2C_INT: IC7.4(INT) IC8.D11(GPIO_B1_03) R17.1
INT_I2C_SCL: IC4.6(SCL) IC7.1(SCL) IC8.C8(GPIO_B0_04) R15.1
INT_I2C_SDA: IC4.5(SDA) IC7.5(SDA) IC8.B8(GPIO_B0_05) R16.1
ISET: R12.1 U2.16(ISET)
JTAG_TCK: FL5.4(INPUT_4) IC8.F12(GPIO_AD_B0_07)
JTAG_TCK_INT: FL5.9(OUTPUT_4) J8.4
JTAG_TDI: FL5.2(INPUT_2) IC8.F14(GPIO_AD_B0_09)
JTAG_TDI_INT: FL5.11(OUTPUT_2) J8.8
JTAG_TDO: FL5.3(INPUT_3) IC8.G13(GPIO_AD_B0_10)
JTAG_TDO_INT: FL5.10(OUTPUT_3) J8.6
JTAG_TMS: FL5.5(INPUT_5) IC8.E14(GPIO_AD_B0_06)
JTAG_TMS_INT: FL5.8(OUTPUT_5) J8.2
JTAG_TRSTB: FL5.6(INPUT_6) IC8.G10(GPIO_AD_B0_11)
JTAG_TRSTB_INT: FL5.7(OUTPUT_6) J8.9
LED_B: IC8.C14(GPIO_B1_14) R19.1
LED_B_INT: D3.1(BLUE) R19.2
LED_CHG: D1.3(RED) R1.2
LED_G: IC8.A10(GPIO_B0_11) R20.1
LED_G_INT: D3.2(GREEN) R20.2
LED_PGOOD: D1.2(GREEN) R4.2
LED_R: IC8.D9(GPIO_B0_10) R21.1
LED_R_INT: D3.3(RED) R21.2
LED_ST: D1.1(BLUE) R5.2
MDI_LED: J3.8 R35.2
MDI_RX_N: IC9.3(RXM) J3.7
MDI_RX_P: IC9.4(RXP) J3.6
MDI_TX_N: IC9.5(TXM) J3.5
MDI_TX_P: IC9.6(TXP) J3.4
NVCC_PLL: C104.2 C107.1 IC8.P10(NVCC_PLL)
ONOFF: IC8.M6(ONOFF) Q3.2(S)
P0_MOSI: FL2.1(INPUT_1) IC8.H10(GPIO_AD_B0_01)
P0_MOSI_INT: FL2.12(OUTPUT_1) J2.8
P1_MISO: FL2.2(INPUT_2) IC8.M11(GPIO_AD_B0_02)
P1_MISO_INT: FL2.11(OUTPUT_2) J2.7
P2_SCLK: FL2.3(INPUT_3) IC8.M14(GPIO_AD_B0_00)
P2_SCLK_INT: FL2.10(OUTPUT_3) J2.6
P3_NSS: FL2.4(INPUT_4) IC8.G11(GPIO_AD_B0_03)
P3_NSS_INT: FL2.9(OUTPUT_4) J2.5
P4_SCL: FL2.5(INPUT_5) IC8.K14(GPIO_AD_B0_12)
P4_SCL_INT: FL2.8(OUTPUT_5) J2.4
P5_SDA: FL2.6(INPUT_6) IC8.L14(GPIO_AD_B0_13)
P5_SDA_INT: FL2.7(OUTPUT_6) J2.3
P6_ADC: FL4.1(INPUT_1) IC8.M12(GPIO_AD_B1_03)
P6_ADC_INT: FL4.12(OUTPUT_1) J2.2
P7_PWM: FL4.2(INPUT_2) IC8.A8(GPIO_B0_06)
P7_PWM_INT: FL4.11(OUTPUT_2) J6.3
P8_PWM: FL4.3(INPUT_3) IC8.A9(GPIO_B0_07)
P8_PWM_INT: FL4.10(OUTPUT_3) J6.4
P9_PWM: FL4.4(INPUT_4) IC8.A11(GPIO_B1_00)
P9_PWM_INT: FL4.9(OUTPUT_4) J6.5
P10_PWM: FL4.5(INPUT_5) Q4.3(D) R26.1
P10_PWM_INT: FL4.8(OUTPUT_5) J6.6
P11_WAKEUP: FL4.6(INPUT_6) Q2.3(D) R22.1
P11_WAKEUP_INT: FL4.7(OUTPUT_6) J6.7
P12_RST_N: C63.1 FL5.1(INPUT_1) IC8.M7(POR_B) R33.2
P12_RST_N_EXT: FL5.12(OUTPUT_1) J6.8 J8.10
P_FLASH_CE: IC5.1(CE#) IC8.L3(GPIO_SD_B1_06) R13.2
P_FLASH_IO0: IC5.5(SI_(IO0)) IC8.P3(GPIO_SD_B1_08)
P_FLASH_IO1: IC5.2(SO_(IO1)) IC8.N4(GPIO_SD_B1_09)
P_FLASH_IO2: IC5.3(WP#_(IO2)) IC8.P4(GPIO_SD_B1_10)
P_FLASH_IO3: IC5.7(HOLD#_(IO3)) IC8.P5(GPIO_SD_B1_11)
P_FLASH_SCK: IC5.6(SCK) IC8.L4(GPIO_SD_B1_07)
PGOOD: R4.1 U2.7(~{PGOOD})
PMIC_ON_REQ: IC8.K7(PMIC_ON_REQ) Q1.2(S)
PMIC_ONOFF: D8.1 J3.3 Q3.3(D) R23.1
PWM_FSIN: IC8.B7(GPIO_EMC_39) Q4.2(S) Q5.2(S) R25.1
REXT: IC9.9(REXT) R38.1
RTC_XTALI: C80.1 IC8.N9(RTC_XTALI) Y1.2
RTC_XTALO: C79.1 IC8.P9(RTC_XTALO) Y1.1
S_FLASH_CE: IC6.1(CE#) IC8.N3(GPIO_SD_B1_05) R14.2
S_FLASH_IO0: IC6.5(SI_(IO0)) IC8.M4(GPIO_SD_B1_03)
S_FLASH_IO1: IC6.2(SO_(IO1)) IC8.M3(GPIO_SD_B1_02)
S_FLASH_IO2: IC6.3(WP#_(IO2)) IC8.M5(GPIO_SD_B1_01)
S_FLASH_IO3: IC6.7(HOLD#_(IO3)) IC8.L5(GPIO_SD_B1_00)
S_FLASH_SCK: IC6.6(SCK) IC8.P2(GPIO_SD_B1_04)
SD_CD: D9.1 IC8.L11(GPIO_AD_B1_02) J5.CD$1(CD) RN1.9
SD_CLK: FL3.4(INPUT_4) IC8.J3(GPIO_SD_B0_01)
SD_CLK_INT: FL3.9(OUTPUT_4) J5.P$5(CLK)
SD_CMD: FL3.3(INPUT_3) IC8.J4(GPIO_SD_B0_00) RN1.12
SD_CMD_INT: FL3.10(OUTPUT_3) J5.P$3(CMD)
SD_DAT0: FL3.5(INPUT_5) IC8.J1(GPIO_SD_B0_02) RN1.14
SD_DAT0_INT: FL3.8(OUTPUT_5) J5.P$7(DAT0)
SD_DAT1: FL3.6(INPUT_6) IC8.K1(GPIO_SD_B0_03) RN1.13
SD_DAT1_INT: FL3.7(OUTPUT_6) J5.P$8(DAT1)
SD_DAT2: FL3.1(INPUT_1) IC8.H2(GPIO_SD_B0_04) RN1.10
SD_DAT2_INT: FL3.12(OUTPUT_1) J5.P$1(DAT2)
SD_DAT3: FL3.2(INPUT_2) IC8.J2(GPIO_SD_B0_05) RN1.11
SD_DAT3_INT: FL3.11(OUTPUT_2) J5.P$2(DAT3/CD)
SDRAM_A0: IC3.H7(A0) IC8.C2(GPIO_EMC_09)
SDRAM_A1: IC3.H8(A1) IC8.G1(GPIO_EMC_10)
SDRAM_A2: IC3.J8(A2) IC8.G3(GPIO_EMC_11)
SDRAM_A3: IC3.J7(A3) IC8.H1(GPIO_EMC_12)
SDRAM_A4: IC3.J3(A4) IC8.A6(GPIO_EMC_13)
SDRAM_A5: IC3.J2(A5) IC8.B6(GPIO_EMC_14)
SDRAM_A6: IC3.H3(A6) IC8.B1(GPIO_EMC_15)
SDRAM_A7: IC3.H2(A7) IC8.A5(GPIO_EMC_16)
SDRAM_A8: IC3.H1(A8) IC8.A4(GPIO_EMC_17)
SDRAM_A9: IC3.G3(A9) IC8.B2(GPIO_EMC_18)
SDRAM_A10: IC3.H9(A10) IC8.G2(GPIO_EMC_23)
SDRAM_A11: IC3.G2(A11) IC8.B4(GPIO_EMC_19)
SDRAM_A12: IC3.G1(A12) IC8.A3(GPIO_EMC_20)
SDRAM_BA0: IC3.G7(BA0) IC8.C1(GPIO_EMC_21)
SDRAM_BA1: IC3.G8(BA1) IC8.F1(GPIO_EMC_22)
SDRAM_CAS: IC3.F7(~{CAS}) IC8.D3(GPIO_EMC_24)
SDRAM_CKE: IC3.F3(CKE) IC8.A2(GPIO_EMC_27)
SDRAM_CLK: IC3.F2(CLK) IC8.B3(GPIO_EMC_26)
SDRAM_CS: IC3.G9(~{CS}) IC8.E1(GPIO_EMC_29) R18.2
SDRAM_DQ0: IC3.A8(DQ0) IC8.E3(GPIO_EMC_00)
SDRAM_DQ1: IC3.B9(DQ1) IC8.F3(GPIO_EMC_01)
SDRAM_DQ2: IC3.B8(DQ2) IC8.F4(GPIO_EMC_02)
SDRAM_DQ3: IC3.C9(DQ3) IC8.G4(GPIO_EMC_03)
SDRAM_DQ4: IC3.C8(DQ4) IC8.F2(GPIO_EMC_04)
SDRAM_DQ5: IC3.D9(DQ5) IC8.G5(GPIO_EMC_05)
SDRAM_DQ6: IC3.D8(DQ6) IC8.H5(GPIO_EMC_06)
SDRAM_DQ7: IC3.E9(DQ7) IC8.H4(GPIO_EMC_07)
SDRAM_DQ8: IC3.E1(DQ8) IC8.C6(GPIO_EMC_30)
SDRAM_DQ9: IC3.D2(DQ9) IC8.C5(GPIO_EMC_31)
SDRAM_DQ10: IC3.D1(DQ10) IC8.D5(GPIO_EMC_32)
SDRAM_DQ11: IC3.C2(DQ11) IC8.C4(GPIO_EMC_33)
SDRAM_DQ12: IC3.C1(DQ12) IC8.D4(GPIO_EMC_34)
SDRAM_DQ13: IC3.B2(DQ13) IC8.E5(GPIO_EMC_35)
SDRAM_DQ14: IC3.B1(DQ14) IC8.C3(GPIO_EMC_36)
SDRAM_DQ15: IC3.A2(DQ15) IC8.E4(GPIO_EMC_37)
SDRAM_DQMH: IC3.F1(DQMH) IC8.D6(GPIO_EMC_38)
SDRAM_DQML: IC3.E8(DQML) IC8.H3(GPIO_EMC_08)
SDRAM_RAS: IC3.F8(~{RAS}) IC8.D2(GPIO_EMC_25)
SDRAM_WE: IC3.F9(~{WE}) IC8.D1(GPIO_EMC_28)
SHELL_GND: C110.1 J1.SH(SHELL_GND) R41.1
SR_VLX: L9.1 U3.34(SR_VLX)
ST: IC1.8(ST) R5.1
SW: IC2.4(SW) L2.1
TMR: R11.1 U2.14(TMR)
TS: R9.1 U2.1(TS)
USB_D_N: FL1.6(D+_2) IC8.M8(USB_OTG1_DN)
USB_D_P: FL1.7(D-_2) IC8.L8(USB_OTG1_DP)
USB_VBUS: FL1.4(ID) J1.A4_B9(VBUS) J1.B4_A9(VBUS) L1.1
VCC_SOC: C34.1 C38.1 C45.1 C46.2 C47.1 C48.1 C49.2 C87.2 C94.2 C97.2 C98.2 C100.2 C103.2 IC8.F6(VDD_SOC_IN_1) IC8.F7(VDD_SOC_IN_2) IC8.F8(VDD_SOC_IN_3) IC8.F9(VDD_SOC_IN_4) IC8.G6(VDD_SOC_IN_5) IC8.G9(VDD_SOC_IN_6) IC8.H6(VDD_SOC_IN_7) IC8.H9(VDD_SOC_IN_8) IC8.J5(DCDC_SENSE) IC8.J9(VDD_SOC_IN_9) L5.1
VDD_HIGH_CAP: C101.2 C102.1 IC8.P8(VDD_HIGH_CAP)
VDD_SNVS: C2.2 C69.1 IC8.M9(VDD_SNVS_IN) U1.1(VOUT)
VDD_SNVS_CAP: C70.1 IC8.M10(VDD_SNVS_CAP)
VDD_USB_CAP: C71.1 C72.2 C73.2 IC8.K8(VDD_USB_CAP)
VDDA: C51.1 C52.2 J4.4 L4.1
VDDA_ADC_3P3: C59.1 C60.2 C61.2 IC8.N14(VDDA_ADC_3P3) L6.1
VIN_LDO: C74.1 C91.2 L9.2 U3.31(VIN_LDO)
WAKEUP: IC8.L6(WAKEUP) Q2.2(S)
WIFI_CLK: IC8.M13(GPIO_AD_B1_09) U3.20(SDIO_CLK)
WIFI_CMD: IC8.H13(GPIO_AD_B1_08) RN2.16 U3.22(SDIO_CMD)
WIFI_D0: IC8.L12(GPIO_AD_B1_04) RN2.14 U3.24(SDIO_DATA_0)
WIFI_D1: IC8.K12(GPIO_AD_B1_05) RN2.12 U3.26(SDIO_DATA_1)
WIFI_D2: IC8.J12(GPIO_AD_B1_06) RN2.15 U3.23(SDIO_DATA_2)
WIFI_D3: IC8.K10(GPIO_AD_B1_07) RN2.13 U3.25(SDIO_DATA_3)
WL_H_WAKE: IC8.E11(GPIO_B0_15) U3.27(WL_GPIO_0_HOST_WAKE)
WL_REG_ON: IC8.E10(GPIO_B0_14) U3.28(WL_REG_ON)
XTALI: C106.1 IC8.P11(XTALI) R40.1 Y2.3(CRYSTAL_2)
XTALO: C105.1 IC8.N11(XTALO) Y2.1(CRYSTAL_1)
NetD7_1: D7.1 J6.2 Q6.D

Not connected (* = marked no-connect by the designer): ANT1 2(NC); IC3 E2(NC); IC4 1(NC_1) 2(NC_2) 3(NC_3) 7(NC_4); IC7 2(NC); IC8 N7(USB_OTG2_DN) N10(GPANAIO) N12(USB_OTG1_CHD_B) N13(CCM_CLK1_P) P6(USB_OTG2_VBUS) P7(USB_OTG2_DP) P13(CCM_CLK1_N); IC9 7(XO) 16(REF_CLK); J1 A8(SBU1) B8(SBU2); J4 1 3 6 7 8 9; J8 7; RN1 15 16; RN2 9 10 11; U3 5(~{BT_UART_RTS_N}) 6(BT_GPIO_3) 7(BT_GPIO_4) 8(BT_PCM_SYNC) 9(BT_PCM_IN) 10(BT_PCM_OUT) 11(BT_PCM_CLK) 13(BT_GPIO_5) 15(WL_GPIO_4) 16(BT_I2S_DO) 17(WL_GPIO_2) 18(WL_GPIO_1)

## Layout directives
differential pair: USB_D_N, USB_D_P
net class SDRAM: SDRAM_A0, SDRAM_A1, SDRAM_A2, SDRAM_A3, SDRAM_A4, SDRAM_A5, SDRAM_A6, SDRAM_A7, SDRAM_A8, SDRAM_A9, SDRAM_A10, SDRAM_A11, SDRAM_A12, SDRAM_BA0, SDRAM_BA1, SDRAM_CAS, SDRAM_CKE, SDRAM_CLK, SDRAM_CS, SDRAM_DQ0, SDRAM_DQ1, SDRAM_DQ2, SDRAM_DQ3, SDRAM_DQ4, SDRAM_DQ5, SDRAM_DQ6, SDRAM_DQ7, SDRAM_DQ8, SDRAM_DQ9, SDRAM_DQ10, SDRAM_DQ11, SDRAM_DQ12, SDRAM_DQ13, SDRAM_DQ14, SDRAM_DQ15, SDRAM_DQMH, SDRAM_DQML, SDRAM_RAS, SDRAM_WE
net class DCMI: DCMI_CLK, DCMI_D0, DCMI_D1, DCMI_D2, DCMI_D3, DCMI_D4, DCMI_D5, DCMI_D6, DCMI_D7, DCMI_FSIN, DCMI_HSYNC, DCMI_MISO, DCMI_MOSI, DCMI_PCLK, DCMI_PWDN, DCMI_RST, DCMI_SCL, DCMI_SCLK, DCMI_SDA, DCMI_SSEL, DCMI_VSYNC

## Notes on the sheet
- USB Connector
- Battery Charging
- Ideal Diode
- SNVS Reg
- Main Regulator
- * Blue LED = VIN Power
- * Green LED = USB Power
- * Red LED = Charging
- * PMIC_REG_ON is level shifted to ensure regulator goes into PFM mode
- * CKE is pulled down by 100K on the RT1052
- 16-BIT SDRAM
- Program QSPI Flash
- Storage QSPI Flash
- Security
- Accelerometer
- RGB LED
- Mechanical
- MIMXRT10XX
- SD CARD
- IMAGE SENSOR CONNECTOR
- I/O HEADERS
- * 8KV ESD Protection on MDI
  pins and the LED pin
- Ethernet
- WiFi/Bluetooth
- * JTAG_MOD is used for BT_REG_ON - the pin is sampled on the
  rising edge of reset and is pulled low by 10K
- JTAG
- * The JTAG Interface is designed to connect to the SEGGER 9-Pin Cortex-M Adapter
- Copyright (c) 2013-2023 OpenMV
- TITLE:
- rt10
- This work is licensed under the Creative Commons Attribution-ShareAlike 3.0 License.
- To view a copy of this license, visit http://creativecommons.org/licenses/by-sa/3.0/
- Document Number:
- REV:
- Date:
- 3/22/2023 6:36:02 AM
- Sheet:
- 1
- (in symbol OMV) OpenMV

## Library data of the parts
ANT1 = AMCA31-2R450G-S1F-T3: ABRACON - AMCA31-2R450G-S1F-T3 - ANTENNA, CHIP, 2.45GHZ, 50 OHM, 1206   Source:  Datasheet; GateName_1: G$1; SymbolName_1: AMCA31-2R450G-S1F-T3; LibraryName: AMCA31-2R450G-S1F-T3; DeviceSetName: AMCA31-2R450G-S1F-T3; HEIGHT: 1.4mm; MANUFACTURER_NAME: ABRACON; MANUFACTURER_PART_NUMBER: AMCA31-2R450G-S1F-T3; MOUSER_PART_NUMBER: 815-CA312R450GS1FT3; MOUSER_PRICE-STOCK: https://www.mouser.co.uk/ProductDetail/ABRACON/AMCA31-2R450G-S1F-T3?qs=AAveGqk956GLuOddQEK40Q%3D%3D; MPN: AMCA31-2R450G-S1F-T3; Part Number: AMCA31-2R450G-S1F-T3
C1-C5 C8-C10 C12 C17 C21 C23 C25 C27 C30 C33 C35 C39-C42 C44 C46 C52 C57 C60 C64 C65 C67 C72 C81 C83 C90-C93 C95 C101 C104 C108 = CAP0402-CAP: CapacitorStandard 0603 ceramic capacitor, and 0.1" leaded capacitor.; MPN: JMK105BBJ475MV-F; GateName_1: G$1; SymbolName_1: CAP; DeviceName: 0402-CAP; LibraryName: sfe; DeviceSetName: CAP; Part Number: JMK105BBJ475MV-F
C6 C7 C14 C18 C29 C32 C37 C49 C51 C58 C61 C73 C85 C96 = 22UF-0805-6.3V-20%: 22ÂµF ceramic capacitors    A capacitor is a passive two-terminal electrical component used to store electrical energy temporarily in an electric field.; MPN: CL21A226MQQNNNE; GateName_1: G$1; SymbolName_1: CAP; PROD_ID: CAP-08402; DeviceName: -0805-6.3V-20%; LibraryName: SparkFun-Capacitors; DeviceSetName: 22UF; Part Number: CL21A226MQQNNNE
C11 C13 C15 C16 C19 C20 C22 C24 C26 C28 C31 C34 C36 C38 C43 C45 C47 C48 C50 C53-C56 C59 C62 C63 C66 C68-C71 C74-C76 C82 C84 C86-C89 C94 C97-C100 C102 C103 C107 C109 = C-EUC0201: CAPACITOR, European symbol; MPN: GRM033R60J224ME15D; GateName_1: G$1; SymbolName_1: C-EU; POPULARITY: 0; DeviceName: C0201; LibraryName: rcl; DeviceSetName: C-EU; SPICEPREFIX: C; Part Number: GRM033R60J224ME15D
C77 = GRM0335C1H1R5BA01D: Chip Capacitor value 1R5   Source:  Datasheet; MANUFACTURER_NAME: Murata Electronics; GateName_1: G$1; SymbolName_1: GRM0335C1H1R5BA01D; LibraryName: GRM0335C1H1R5BA01D; DeviceSetName: GRM0335C1H1R5BA01D; HEIGHT: 0.33mm; MANUFACTURER_PART_NUMBER: GRM0335C1H1R5BA01D; MOUSER_PART_NUMBER: 81-GRM0335C1H1R5BA1D; MOUSER_PRICE-STOCK: https://www.mouser.co.uk/ProductDetail/Murata-Electronics/GRM0335C1H1R5BA01D?qs=7vGxPDjevFPFqveGwv%252BPUQ%3D%3D; MPN: GRM0335C1H1R5BA01D; Part Number: GRM0335C1H1R5BA01D
C78 = GRM0335C1H1R5BA01D: Chip Capacitor value 1R5   Source:  Datasheet; MANUFACTURER_NAME: Murata Electronics; GateName_1: G$1; POPULATE: 0; SymbolName_1: GRM0335C1H1R5BA01D; LibraryName: GRM0335C1H1R5BA01D; DeviceSetName: GRM0335C1H1R5BA01D; HEIGHT: 0.33mm; MANUFACTURER_PART_NUMBER: GRM0335C1H1R5BA01D; MOUSER_PART_NUMBER: 81-GRM0335C1H1R5BA1D; MOUSER_PRICE-STOCK: https://www.mouser.co.uk/ProductDetail/Murata-Electronics/GRM0335C1H1R5BA01D?qs=7vGxPDjevFPFqveGwv%252BPUQ%3D%3D; MPN: DNP; Part Number: DNP
C79 C80 = C-EUC0201: CAPACITOR, European symbol; MPN: GRM0335C1E180JA01D; GateName_1: G$1; SymbolName_1: C-EU; POPULARITY: 0; DeviceName: C0201; LibraryName: rcl; DeviceSetName: C-EU; SPICEPREFIX: C; Part Number: GRM0335C1E180JA01D
C105 C106 = C-EUC0201: CAPACITOR, European symbol; MPN: GRM0335C1E4R7CA01D; GateName_1: G$1; SymbolName_1: C-EU; POPULARITY: 0; DeviceName: C0201; LibraryName: rcl; DeviceSetName: C-EU; SPICEPREFIX: C; Part Number: GRM0335C1E4R7CA01D
C110 = CAP0402-CAP: Capacitor; MPN: VJ0402Y102JXACW1BC; GateName_1: G$1; SymbolName_1: CAP; DeviceName: 0402-CAP; LibraryName: sfe; DeviceSetName: CAP; Part Number: VJ0402Y102JXACW1BC
CN1 = JST_2PIN-THM-RA: JST 2-Pin Connectors of various flavors SMT-RA (S2B-PH-SM4) 4UConnector #17311  SMT  (B2B-PH-SM4)  THM-RA (S2B-PH)  THM  (B2B-PH); GateName_1: G$1; SymbolName_1: PINHD2; DeviceName: -THM-RA; LibraryName: adafruit-updated; DeviceSetName: JST_2PIN; MPN: S2B-PH-K-S(LF)(SN); Part Number: S2B-PH-K-S(LF)(SN)
D1 D3 = UHD1110-FKA-CL1A13R3Q1BBQFMF3: LED RGB SMD, SIZE 1 X 1 mm Check availability; GateName_1: G$1; MF: Cree Inc.; SymbolName_1: UHD1110-FKA-CL1A13R3Q1BBQFMF3; LibraryName: UHD1110-FKA-CL1A13R3Q1BBQFMF3; DeviceSetName: UHD1110-FKA-CL1A13R3Q1BBQFMF3; AVAILABILITY: In Stock; MP: UHD1110-FKA-CL1A13R3Q1BBQFMF3; MPN: UHD1110-FKA-CL1A13r3q1BBQFMF3; PACKAGE: 0404 Cree Inc.; PRICE: None; PURCHASE-URL: https://pricing.snapeda.com/search/part/UHD1110-FKA-CL1A13R3Q1BBQFMF3/?ref=eda; Part Number: UHD1110-FKA-CL1A13r3q1BBQFMF3
D2 D4-D10 = CPDQT5V0HE-HF: ESD Suppressors / TVS Diodes DIODE ESD 5VWM 65W 0402/SOD-923F   Source:  Datasheet; MANUFACTURER_NAME: Comchip Technology; GateName_1: G$1; SymbolName_1: CPDQT5V0HE-HF; LibraryName: CPDQT5V0HE-HF; DeviceSetName: CPDQT5V0HE-HF; HEIGHT: 0.42mm; MANUFACTURER_PART_NUMBER: CPDQT5V0HE-HF; MOUSER_PART_NUMBER: MOUSER_PART_NUMBER; MOUSER_PRICE-STOCK: MOUSER_PRICE-STOCK; MPN: CPDQT5V0HE-HF; Part Number: CPDQT5V0HE-HF
FD1-FD8 = FIDUCIAL1X2: Fiducial Alignment Points    Point-of-reference for pick-and-place machines and other optical instruments.; GateName_1: G$1; DeviceName: 1X2; SymbolName_1: FIDUCIAL; LibraryName: SparkFun-Aesthetics; DeviceSetName: FIDUCIAL
FL1 = ECMF02-4CMX8: Common Mode Filter & ESD Prot. USB uQFN8 STMicroelectronics ECMF02 Series, Signal Filter uQFN SMD, Flat Contact Termination, 2.6 x 1.3 x 0.6mm   Source:  Datasheet; GateName_1: G$1; SymbolName_1: ECMF02-4CMX8; LibraryName: ECMF02-4CMX8; DeviceSetName: ECMF02-4CMX8; HEIGHT: mm; MANUFACTURER_NAME: STMicroelectronics; MANUFACTURER_PART_NUMBER: ECMF02-4CMX8; MOUSER_PART_NUMBER: 511-ECMF02-4CMX8; MOUSER_PRICE-STOCK: https://www.mouser.co.uk/ProductDetail/STMicroelectronics/ECMF02-4CMX8?qs=xYt8xtm2zhmK7GoDlDZR3A%3D%3D; MPN: ECMF02-4CMX8; Part Number: ECMF02-4CMX8
FL2-FL5 = EMIF06-1005M12: EMI Filter Circuits 6lin lw cpcitnc EMI 45pF -35db @ 900MHz   Source:  Datasheet; MANUFACTURER_NAME: STMicroelectronics; GateName_1: G$1; SymbolName_1: EMIF06-1005M12; LibraryName: EMIF06-1005M12; DeviceSetName: EMIF06-1005M12; HEIGHT: 0.65mm; MANUFACTURER_PART_NUMBER: EMIF06-1005M12; MOUSER_PART_NUMBER: 511-EMIF06-1005M12; MOUSER_PRICE-STOCK: https://www.mouser.co.uk/ProductDetail/STMicroelectronics/EMIF06-1005M12?qs=VJaATVMq%252BXo0u09ZqtQg3A%3D%3D; MPN: EMIF06-1005M12; Part Number: EMIF06-1005M12
IC1 = LM66200DRLR: 1.6-V to 5.5-V, 40-m, 2.5-A, low-IQ, dual ideal diode   Source:  Datasheet; MANUFACTURER_NAME: Texas Instruments; GateName_1: G$1; SymbolName_1: LM66200DRLR; LibraryName: LM66200DRLR; DeviceSetName: LM66200DRLR; HEIGHT: 0.6mm; MANUFACTURER_PART_NUMBER: LM66200DRLR; MOUSER_PART_NUMBER: 595-LM66200DRLR; MOUSER_PRICE-STOCK: https://www.mouser.co.uk/ProductDetail/Texas-Instruments/LM66200DRLR?qs=Rp5uXu7WBW90hnpZAkIOdQ%3D%3D; MPN: LM66200DRLR; Part Number: LM66200DRLR
IC2 = AP61300Z6-7: DCDC Conv LV Buck SOT563 T&R 3K   Source:  Datasheet; MANUFACTURER_NAME: Diodes Inc.; GateName_1: G$1; SymbolName_1: AP61300Z6-7; LibraryName: AP61300Z6-7; DeviceSetName: AP61300Z6-7; HEIGHT: 0.6mm; MANUFACTURER_PART_NUMBER: AP61300Z6-7; MOUSER_PART_NUMBER: 621-AP61300Z6-7; MOUSER_PRICE-STOCK: https://www.mouser.co.uk/ProductDetail/Diodes-Incorporated/AP61300Z6-7?qs=HBWAp0VN4Ri0dzb0XP2pEA%3D%3D; MPN: AP61300Z6-7; Part Number: AP61300Z6-7
IC3 = IS42S16160G-6BL: DRAM 256M 16Mx16 166Mhz SDR SDRAM, 3.3V   Source:  Datasheet; MANUFACTURER_NAME: Integrated Silicon Solution Inc.; GateName_1: G$1; SymbolName_1: IS42S16160G-6BL; LibraryName: IS42S16160G-6BL; DeviceSetName: IS42S16160G-6BL; HEIGHT: 1.2mm; MANUFACTURER_PART_NUMBER: IS42S16160G-6BL; MOUSER_PART_NUMBER: 870-IS42S16160G-6BL; MOUSER_PRICE-STOCK: https://www.mouser.co.uk/ProductDetail/ISSI/IS42S16160G-6BL?qs=9hm%252BDT1Jr7yvZBhvmJyecQ%3D%3D; MPN: IS42S16160G-6BL; Part Number: IS42S16160G-6BL
IC4 = ATECC608B-MAHDA-T: CryptoAuthentication 8-Pin UDFN EP T/R   Source:  Datasheet; MANUFACTURER_NAME: Microchip; GateName_1: G$1; SymbolName_1: ATECC608B-MAHDA-T; LibraryName: ATECC608B-MAHDA-T; DeviceSetName: ATECC608B-MAHDA-T; HEIGHT: 0.6mm; MANUFACTURER_PART_NUMBER: ATECC608B-MAHDA-T; MOUSER_PART_NUMBER: 579-TECC608B-MAHDA-T; MOUSER_PRICE-STOCK: https://www.mouser.co.uk/ProductDetail/Microchip-Technology/ATECC608B-MAHDA-T?qs=W%2FMpXkg%252BdQ71cGyt0Wo3Jw%3D%3D; MPN: ATECC608B-MAHDA-T; Part Number: ATECC608B-MAHDA-T
IC5 = IS25LP064D-JKLE-TR: NOR Flash 64M 2.3-3.6V 166Mhz Serial NOR Flash   Source:  Datasheet; MANUFACTURER_NAME: Integrated Silicon Solution Inc.; GateName_1: G$1; SymbolName_1: IS25LP064D-JKLE-TR; LibraryName: IS25LP128F-JKLE-TR; DeviceSetName: IS25LP064D-JKLE-TR; HEIGHT: 0.8mm; MANUFACTURER_PART_NUMBER: IS25LP064D-JKLE-TR; MOUSER_PART_NUMBER: 870-5LP064D-JKLE-TR; MOUSER_PRICE-STOCK: https://www.mouser.com/ProductDetail/ISSI/IS25LP064D-JKLE-TR?qs=xZ%2FP%252Ba9zWqa2pmLA1ByOew%3D%3D; MPN: IS25LP064D-JKLE-TR; Part Number: IS25LP064D-JKLE-TR
IC6 = IS25LP128F-JKLE-TR: NOR Flash 128M 2.3-3.6V 166Mhz Serial NOR Flash   Source:  Datasheet; MANUFACTURER_NAME: Integrated Silicon Solution Inc.; GateName_1: G$1; SymbolName_1: IS25LP128F-JKLE-TR; LibraryName: IS25LP128F-JKLE-TR; DeviceSetName: IS25LP128F-JKLE-TR; HEIGHT: 0.8mm; MANUFACTURER_PART_NUMBER: IS25LP128F-JKLE-TR; MOUSER_PART_NUMBER: 870-IS25LP128FJKLETR; MOUSER_PRICE-STOCK: https://www.mouser.co.uk/ProductDetail/ISSI/IS25LP128F-JKLE-TR?qs=F5EMLAvA7IC8MN2X519UUw%3D%3D; MPN: IS25LP128F-JKLE-TR; Part Number: IS25LP128F-JKLE-TR
IC7 = MXC4005XC: Accelerometers Monolithic and Wafer Level Packaged Three-Axis Accelerometer   Source:  Datasheet; MANUFACTURER_NAME: MEMSIC; GateName_1: G$1; SymbolName_1: MXC4005XC; LibraryName: MXC4005XC; DeviceSetName: MXC4005XC; HEIGHT: 0.885mm; MANUFACTURER_PART_NUMBER: MXC4005XC; MOUSER_PART_NUMBER: 438-MXC4005XC; MOUSER_PRICE-STOCK: https://www.mouser.co.uk/ProductDetail/MEMSIC/MXC4005XC?qs=RcG8xmE7yp3iyYgWLmAtUw%3D%3D; MPN: MXC4005XC; Part Number: MXC4005XC
IC8 = MIMXRT1052DVL6B: Processors - Application Specialized MIMXRT1052DVL6B/LFBGA196///STANDARD MARKING * TRAY   Source:  Datasheet; MANUFACTURER_NAME: NXP; GateName_1: G$1; SymbolName_1: MIMXRT1052DVL6B; LibraryName: MIMXRT1052DVL6B; DeviceSetName: MIMXRT1052DVL6B; HEIGHT: 1.43mm; MANUFACTURER_PART_NUMBER: MIMXRT1052DVL6B; MOUSER_PART_NUMBER: 771-MIMXRT1052DVL6B; MOUSER_PRICE-STOCK: https://www.mouser.co.uk/ProductDetail/NXP-Semiconductors/MIMXRT1052DVL6B?qs=r5DSvlrkXmLhWvqckzJtSg%3D%3D; MPN: MIMXRT1052DVL6B; Part Number: MIMXRT1052DVL6B
IC9 = KSZ8081RNDCA-TR: Ethernet ICs 10/100 BASE-TX Physical Layer Transceiver   Source:  Datasheet; MANUFACTURER_NAME: Microchip; GateName_1: G$1; SymbolName_1: KSZ8081RNDCA-TR; LibraryName: KSZ8081RNDCA-TR; DeviceSetName: KSZ8081RNDCA-TR; HEIGHT: 0.9mm; MANUFACTURER_PART_NUMBER: KSZ8081RNDCA-TR; MOUSER_PART_NUMBER: 998-KSZ8081RNDCATR; MOUSER_PRICE-STOCK: https://www.mouser.co.uk/ProductDetail/Microchip-Technology-Atmel/KSZ8081RNDCA-TR?qs=U6T8BxXiZAXLXXdn%2FieQKw%3D%3D; MPN: KSZ8081RNDCA-TR; Part Number: KSZ8081RNDCA-TR
J1 = USB4105-GF-A: USB-C (USB TYPE-C) USB 2.0 Receptacle Connector 24 (16+8 Dummy) Position Surface Mount, Right Angle; Through Hole  Check availability; GateName_1: G$1; MF: GCT; SymbolName_1: USB4105-GF-A; LibraryName: USB4105-GF-A; DeviceSetName: USB4105-GF-A; AVAILABILITY: In Stock; MP: USB4105-GF-A; MPN: USB4105-GF-A; PACKAGE: None; PRICE: None; PURCHASE-URL: https://pricing.snapeda.com/search/part/USB4105-GF-A/?ref=eda; Part Number: USB4105-GF-A
J2 J3 J6 = CONN_08": Multi connection point. Often used as Generic Header-pin footprint for 0.1 inch spaced/style header connections    On any of the 0.1 inch spaced packages, you can populate with these:  Break Away Headers - Straight (PRT-00116)   Break Away Male Headers - Right Angle (PRT-00553)   Female Headers (PRT-00115)   Break Away Headers - Machine Pin (PRT-00117)   Break Away Female Headers - Swiss Machine Pin (PRT-00743)   Arduino Stackable Header - 8 Pin (PRT-09279)        For SCREWTERMINALS and SPRING TERMINALS visit here:  Screw Terimnals on SparkFun.com (5mm/3.5mm/2.54mm spacing)       This device is also useful as a general connection point to wire up your design to another part of your project. Our various solder wires solder well into these plated through hole pads.  Hook-Up Wire - Assortment (Stranded, 22 AWG) (PRT-11375)   Hook-Up Wire - Assortment (Solid Core, 22 AWG) (PRT-11367)   View the entire wire category on our website here          Special notes:     Molex polarized connector foot print use with SKU : PRT-08231 with associated crimp pins and housings. 1MM SMD Version SKU: PRT-10208    NOTES ON THE VARIANTS LOCK and LOCK_LONGPADS... This footprint was designed to help hold the alignment of a through-hole component (i.e.  6-pin header) while soldering it into place. You may notice that each hole has been shifted either up or down by 0.005 of an inch from it's more standard position (which is a perfectly straight line).  This slight alteration caused the pins (the squares in the middle) to touch the edges of the holes.  Because they are alternating, it causes a "brace" to hold the component in place.  0.005 has proven to be the perfect amount of "off-center" position when using our standard breakaway headers. Although looks a little odd when you look at the bare footprint, once you have a header in there, the alteration is very hard to notice.  Also,if you push a header all the way into place, it is covered up entirely on the bottom side.; GateName_1: G$1; DeviceName: "; POPULATE: 0; PROD_ID: CONN-08438; SymbolName_1: CONN_08; LibraryName: SparkFun-Connectors; DeviceSetName: CONN_08; MPN: DNP; Part Number: DNP
J4 = DF12-36-DS: Header; MPN: DF12NB-36DS-0.5V(51); GateName_1: G$1; SymbolName_1: DF12-36; LibraryName: DF12-36-DS; DeviceSetName: DF12-36-DS; Part Number: DF12NB-36DS-0.5V(51)
J5 = USD-1040310811: uSD Slot; MPN: 104031-0811; GateName_1: G$1; SymbolName_1: USD; LibraryName: 1040310811; DeviceSetName: USD-1040310811; Part Number: 104031-0811
J7 = 2337019-1: RF Connectors / Coaxial Connectors MicroCoax receptacle UMCC Gen 1   Source:  Datasheet; MANUFACTURER_NAME: TE Connectivity; GateName_1: G$1; POPULATE: 0; SymbolName_1: 2337019-1; LibraryName: 2337019-1; DeviceSetName: 2337019-1; HEIGHT: 1.4mm; MANUFACTURER_PART_NUMBER: 2337019-1; MOUSER_PART_NUMBER: 571-2337019-1; MOUSER_PRICE-STOCK: https://www.mouser.co.uk/ProductDetail/TE-Connectivity/2337019-1?qs=l4Gc20tDgJIuN7nS9rJkJw%3D%3D; MPN: 2337019-1; Part Number: 2337019-1
J8 = 3221-10-0300-00: Check availability; GateName_1: G$1; MF: CNC Tech; SymbolName_1: 3221-10-0300-00; LibraryName: 3221-10-0300-00; DeviceSetName: 3221-10-0300-00; AVAILABILITY: In Stock; MP: 3221-10-0300-00; MPN: 3221-10-0300-00; PACKAGE: None; PRICE: None; PURCHASE-URL: https://pricing.snapeda.com/search/part/3221-10-0300-00/?ref=eda; Part Number: 3221-10-0300-00
L1 = INDUCTOR: InductorsBasic Inductor/Choke - 0603 and 1206. Footprints are not proven and vary greatly between part numbers.; GateName_1: G$1; MPN: MFBM1V1608-101-R; Part Number: MFBM1V1608-101-R
L2 = MAKK2016T1R0M: Ind Power Wirewound 1uH 20% 2MHz Metal 2200mA 0806 Check availability; GateName_1: G$1; MF: Taiyo Yuden; SymbolName_1: MAKK2016T1R0M; LibraryName: MAKK2016T1R0M; DeviceSetName: MAKK2016T1R0M; AVAILABILITY: In Stock; MP: MAKK2016T1R0M; MPN: MAKK2016T1R0M; PACKAGE: 2016 Taiyo Yuden; PRICE: None; PURCHASE-URL: https://pricing.snapeda.com/search/part/MAKK2016T1R0M/?ref=eda; Part Number: MAKK2016T1R0M
L4 L6 L8 = INDUCTOR0402: InductorsBasic Inductor/Choke - 0603 and 1206. Footprints are not proven and vary greatly between part numbers.; MPN: MFBM1V1005-101-R; GateName_1: G$1; DeviceName: 0402; SymbolName_1: INDUCTOR; LibraryName: sfe; DeviceSetName: INDUCTOR; Part Number: MFBM1V1005-101-R
L5 = MAKK2016T4R7M: INDUCTOR, METAL CORE, SHIELDED, SMD HIGH CURRENT, 4.7uH, 20%, TR Check availability; GateName_1: G$1; MF: Taiyo Yuden; SymbolName_1: MAKK2016T4R7M; LibraryName: MAKK2016T4R7M; DeviceSetName: MAKK2016T4R7M; AVAILABILITY: In Stock; MP: MAKK2016T4R7M; MPN: MAKK2016T4R7M; PACKAGE: 2016 Taiyo Yuden; PRICE: None; PURCHASE-URL: https://pricing.snapeda.com/search/part/MAKK2016T4R7M/?ref=eda; Part Number: MAKK2016T4R7M
L7 = INDUCTOR-0402-3.9NH: Inductors    Resist changes in electrical current. Basically a coil of wire.   SparkFun Products:  SparkFun Load Cell Amplifier - HX711  IOIO-OTG - V2.2; MPN: L-07C3N9SV6T; GateName_1: G$1; PROD_ID: NDUC-13457; SymbolName_1: INDUCTOR; DeviceName: -0402-3.9NH; LibraryName: SparkFun-Coils; DeviceSetName: INDUCTOR; Part Number: L-07C3N9SV6T
L9 = MAKK2016T2R2M: INDUCTOR, METAL CORE Check availability; GateName_1: G$1; MF: Taiyo Yuden; SymbolName_1: MAKK2016T2R2M; LibraryName: MAKK2016T2R2M; DeviceSetName: MAKK2016T2R2M; AVAILABILITY: In Stock; MP: MAKK2016T2R2M; MPN: MAKK2016T2R2M; PACKAGE: 2016 Taiyo Yuden; PRICE: None; PURCHASE-URL: https://pricing.snapeda.com/search/part/MAKK2016T2R2M/?ref=eda; Part Number: MAKK2016T2R2M
M1 M2 = 9774030243R: M2 3mm Standoff; GateName_1: G$1; SymbolName_1: 9774030243R; LibraryName: 9774030243R; DeviceSetName: 9774030243R; MPN: 9774030243R; Part Number: 9774030243R
P1 P2 = OMV
P3 = ROHS
P4 = WEEE
Q1-Q5 = 2N7002KW_R1_00001: MOSFET 60V N-Channel Enhancement Mode MOSFET - ESD Protected   Source:  Datasheet; MANUFACTURER_NAME: PANJIT; GateName_1: G$1; SymbolName_1: 2N7002KW_R1_00001; LibraryName: 2N7002KW_R1_00001; DeviceSetName: 2N7002KW_R1_00001; HEIGHT: 1.1mm; MANUFACTURER_PART_NUMBER: 2N7002KW_R1_00001; MOUSER_PART_NUMBER: 241-2N7002KWR100001; MOUSER_PRICE-STOCK: https://www.mouser.co.uk/ProductDetail/Panjit/2N7002KW_R1_00001?qs=sPbYRqrBIVliWKATqv7jNA%3D%3D; MPN: 2N7002KW_R1_00001; Part Number: 2N7002KW_R1_00001
Q6 = PMXB120EPEZ: PMOS; GateName_1: G$1; HEIGHT: 1.1mm; MPN: PMXB120EPEZ; Part Number: PMXB120EPEZ
R1 R4 R5 R26 R36 R39 = RESISTOR0402-RES: ResistorBasic schematic elements and footprints for 0603, 1206, and PTH resistors.; MPN: CRCW04021K00FKEDC; GateName_1: G$1; SymbolName_1: RESISTOR; DeviceName: 0402-RES; LibraryName: sfe; DeviceSetName: RESISTOR; Part Number: CRCW04021K00FKEDC
R2 = RESISTOR0402-RES: ResistorBasic schematic elements and footprints for 0603, 1206, and PTH resistors.; MPN: CRCW0402200KFKEDC; GateName_1: G$1; SymbolName_1: RESISTOR; DeviceName: 0402-RES; LibraryName: sfe; DeviceSetName: RESISTOR; Part Number: CRCW0402200KFKEDC
R3 R13 R14 R18 R22-R25 R27-R29 R34 = RESISTOR0402-RES: ResistorBasic schematic elements and footprints for 0603, 1206, and PTH resistors.; MPN: AC0402FR-07100KL; GateName_1: G$1; SymbolName_1: RESISTOR; DeviceName: 0402-RES; LibraryName: sfe; DeviceSetName: RESISTOR; Part Number: AC0402FR-07100KL
R6 R7 = RESISTOR0402-RES: ResistorBasic schematic elements and footprints for 0603, 1206, and PTH resistors.; MPN: RC0402JR-075K1L; GateName_1: G$1; SymbolName_1: RESISTOR; DeviceName: 0402-RES; LibraryName: sfe; DeviceSetName: RESISTOR; Part Number: RC0402JR-075K1L
R8 = RESISTOR0402-RES: ResistorBasic schematic elements and footprints for 0603, 1206, and PTH resistors.; MPN: AC0402FR-0744K2L; GateName_1: G$1; SymbolName_1: RESISTOR; DeviceName: 0402-RES; LibraryName: sfe; DeviceSetName: RESISTOR; Part Number: AC0402FR-0744K2L
R9 R33 R37 = RESISTOR0402-RES: ResistorBasic schematic elements and footprints for 0603, 1206, and PTH resistors.; MPN: AC0402FR-1310KL; GateName_1: G$1; SymbolName_1: RESISTOR; DeviceName: 0402-RES; LibraryName: sfe; DeviceSetName: RESISTOR; Part Number: AC0402FR-1310KL
R10 = RESISTOR0402-RES: ResistorBasic schematic elements and footprints for 0603, 1206, and PTH resistors.; MPN: CRCW04023K30FKEDC; GateName_1: G$1; SymbolName_1: RESISTOR; DeviceName: 0402-RES; LibraryName: sfe; DeviceSetName: RESISTOR; Part Number: CRCW04023K30FKEDC
R11 = RESISTOR0402-RES: ResistorBasic schematic elements and footprints for 0603, 1206, and PTH resistors.; MPN: WR04X4642FTL; GateName_1: G$1; SymbolName_1: RESISTOR; DeviceName: 0402-RES; LibraryName: sfe; DeviceSetName: RESISTOR; Part Number: WR04X4642FTL
R12 = RESISTOR0402-RES: ResistorBasic schematic elements and footprints for 0603, 1206, and PTH resistors.; MPN: RC0402JR-078K2L; GateName_1: G$1; SymbolName_1: RESISTOR; DeviceName: 0402-RES; LibraryName: sfe; DeviceSetName: RESISTOR; Part Number: RC0402JR-078K2L
R15-R17 = RESISTOR0402-RES: ResistorBasic schematic elements and footprints for 0603, 1206, and PTH resistors.; MPN: AC0402JR-072K7L; GateName_1: G$1; SymbolName_1: RESISTOR; DeviceName: 0402-RES; LibraryName: sfe; DeviceSetName: RESISTOR; Part Number: AC0402JR-072K7L
R19-R21 R35 = RESISTOR0402-RES: ResistorBasic schematic elements and footprints for 0603, 1206, and PTH resistors.; MPN: CRGCQ0402F220R; GateName_1: G$1; SymbolName_1: RESISTOR; DeviceName: 0402-RES; LibraryName: sfe; DeviceSetName: RESISTOR; Part Number: CRGCQ0402F220R
R30 R31 = RESISTOR0402-RES: ResistorBasic schematic elements and footprints for 0603, 1206, and PTH resistors.; MPN: AC0402FR-074K7L; GateName_1: G$1; SymbolName_1: RESISTOR; DeviceName: 0402-RES; LibraryName: sfe; DeviceSetName: RESISTOR; Part Number: AC0402FR-074K7L
R32 = RESISTOR0402-RES: ResistorBasic schematic elements and footprints for 0603, 1206, and PTH resistors.; MPN: RC0201FR-0730KL; GateName_1: G$1; SymbolName_1: RESISTOR; DeviceName: 0402-RES; LibraryName: sfe; DeviceSetName: RESISTOR; Part Number: RC0201FR-0730KL
R38 = RESISTOR0402-RES: ResistorBasic schematic elements and footprints for 0603, 1206, and PTH resistors.; MPN: CR0402-FX-6491GLF; GateName_1: G$1; SymbolName_1: RESISTOR; DeviceName: 0402-RES; LibraryName: sfe; DeviceSetName: RESISTOR; Part Number: CR0402-FX-6491GLF
R40 = RESISTOR0402-RES: ResistorBasic schematic elements and footprints for 0603, 1206, and PTH resistors.; MPN: RC0402FR-072M2L; GateName_1: G$1; SymbolName_1: RESISTOR; DeviceName: 0402-RES; LibraryName: sfe; DeviceSetName: RESISTOR; Part Number: RC0402FR-072M2L
R41 = RESISTOR0402-RES: Resistor; MPN: CRCW04021M00FKEDC; GateName_1: G$1; SymbolName_1: RESISTOR; DeviceName: 0402-RES; LibraryName: sfe; DeviceSetName: RESISTOR; Part Number: CRCW04021M00FKEDC
RN1 RN2 = EXB-2HV104JV: Resistor Networks & Arrays Resistor Array Chip 8 Elements 1506   Source:  Datasheet; MANUFACTURER_NAME: Panasonic; GateName_1: G$1; SymbolName_1: EXB-2HV104JV; LibraryName: EXB-2HV104JV; DeviceSetName: EXB-2HV104JV; HEIGHT: 0.55mm; MANUFACTURER_PART_NUMBER: EXB-2HV104JV; MOUSER_PART_NUMBER: 667-EXB-2HV104JV; MOUSER_PRICE-STOCK: https://www.mouser.co.uk/ProductDetail/Panasonic/EXB-2HV104JV?qs=9MgLB97nXf9MD%252BafCCtPcA%3D%3D; MPN: EXB-2HV104JV; Part Number: EXB-2HV104JV
U1 = MIC5365-3.3YMT-TZ: LDO; GateName_1: G$1; SymbolName_1: VREG_MIC5365-3.3YMT-TZ; LibraryName: MIC5365-3.3YMT-TZ; DeviceSetName: MIC5365-3.3YMT-TZ; MPN: MIC5365-3.3YMT-TZ; Part Number: MIC5365-3.3YMT-TZ
U2 = BQ24075RGTR: Standalone 1-cell 1.5-A linear charger, Power Path, 4.2-V VBAT and 5.5-V VOUT 16-VQFN -40 to 85  Check availability; GateName_1: G$1; MF: Texas Instruments; SymbolName_1: BQ24075RGTR; LibraryName: BQ24075RGTR; DeviceSetName: BQ24075RGTR; AVAILABILITY: In Stock; MP: BQ24075RGTR; MPN: BQ24075RGTR; PACKAGE: VQFN-16 Texas Instruments; PRICE: None; PURCHASE-URL: https://pricing.snapeda.com/search/part/BQ24075RGTR/?ref=eda; Part Number: BQ24075RGTR
U3 = LBEE5KL1DX-TEMP: Broadcom Chipset for 802.11b/g/n + Bluetooth 4.1/EDR; GateName_1: G$1; MF: Murata Electronics; SymbolName_1: LBEE5KL1DX-TEMP; LibraryName: LBEE5KL1DX-TEMP; DeviceSetName: LBEE5KL1DX-TEMP; AVAILABILITY: Unavailable; MP: LBEE5KL1DX-TEMP; MPN: LBEE5KL1DX-883; PACKAGE: None; PRICE: None; Part Number: LBEE5KL1DX-883
Y1 = ABS07-32.768KHZ-7-T: Check availability; GateName_1: G$1; MF: Abracon; SymbolName_1: ABS07-32.768KHZ-7-T; LibraryName: ABS07-32.768KHZ-7-T; DeviceSetName: ABS07-32.768KHZ-7-T; AVAILABILITY: In Stock; MP: ABS07-32.768KHZ-7-T; MPN: SC32S-7PF20PPM; PACKAGE: SMD-2 Abracon LLC; PRICE: None; PURCHASE-URL: https://pricing.snapeda.com/search/part/ABS07-32.768KHZ-7-T/?ref=eda; Part Number: SC32S-7PF20PPM
Y2 = XRCGB24M000F3M00R0: Murata 24MHz Crystal +/-30ppm SMD 4-Pin 2 x 1.6 x 0.7mm   Source:  Datasheet; MANUFACTURER_NAME: Murata Electronics; GateName_1: G$1; SymbolName_1: XRCGB24M000F3M00R0; LibraryName: XRCGB24M000F3M00R0; DeviceSetName: XRCGB24M000F3M00R0; HEIGHT: mm; MANUFACTURER_PART_NUMBER: XRCGB24M000F3M00R0; MOUSER_PART_NUMBER: 81-XRCGB24M000F3M0R0; MOUSER_PRICE-STOCK: https://www.mouser.co.uk/ProductDetail/Murata-Electronics/XRCGB24M000F3M00R0?qs=e%252BE4OD6MgMefDn8VvwDdfw%3D%3D; MPN: XRCGB24M000F3M00R0; Part Number: XRCGB24M000F3M00R0